# Altium project HYDRA_V4_NAV.PrjPcb (part 1 of 2)
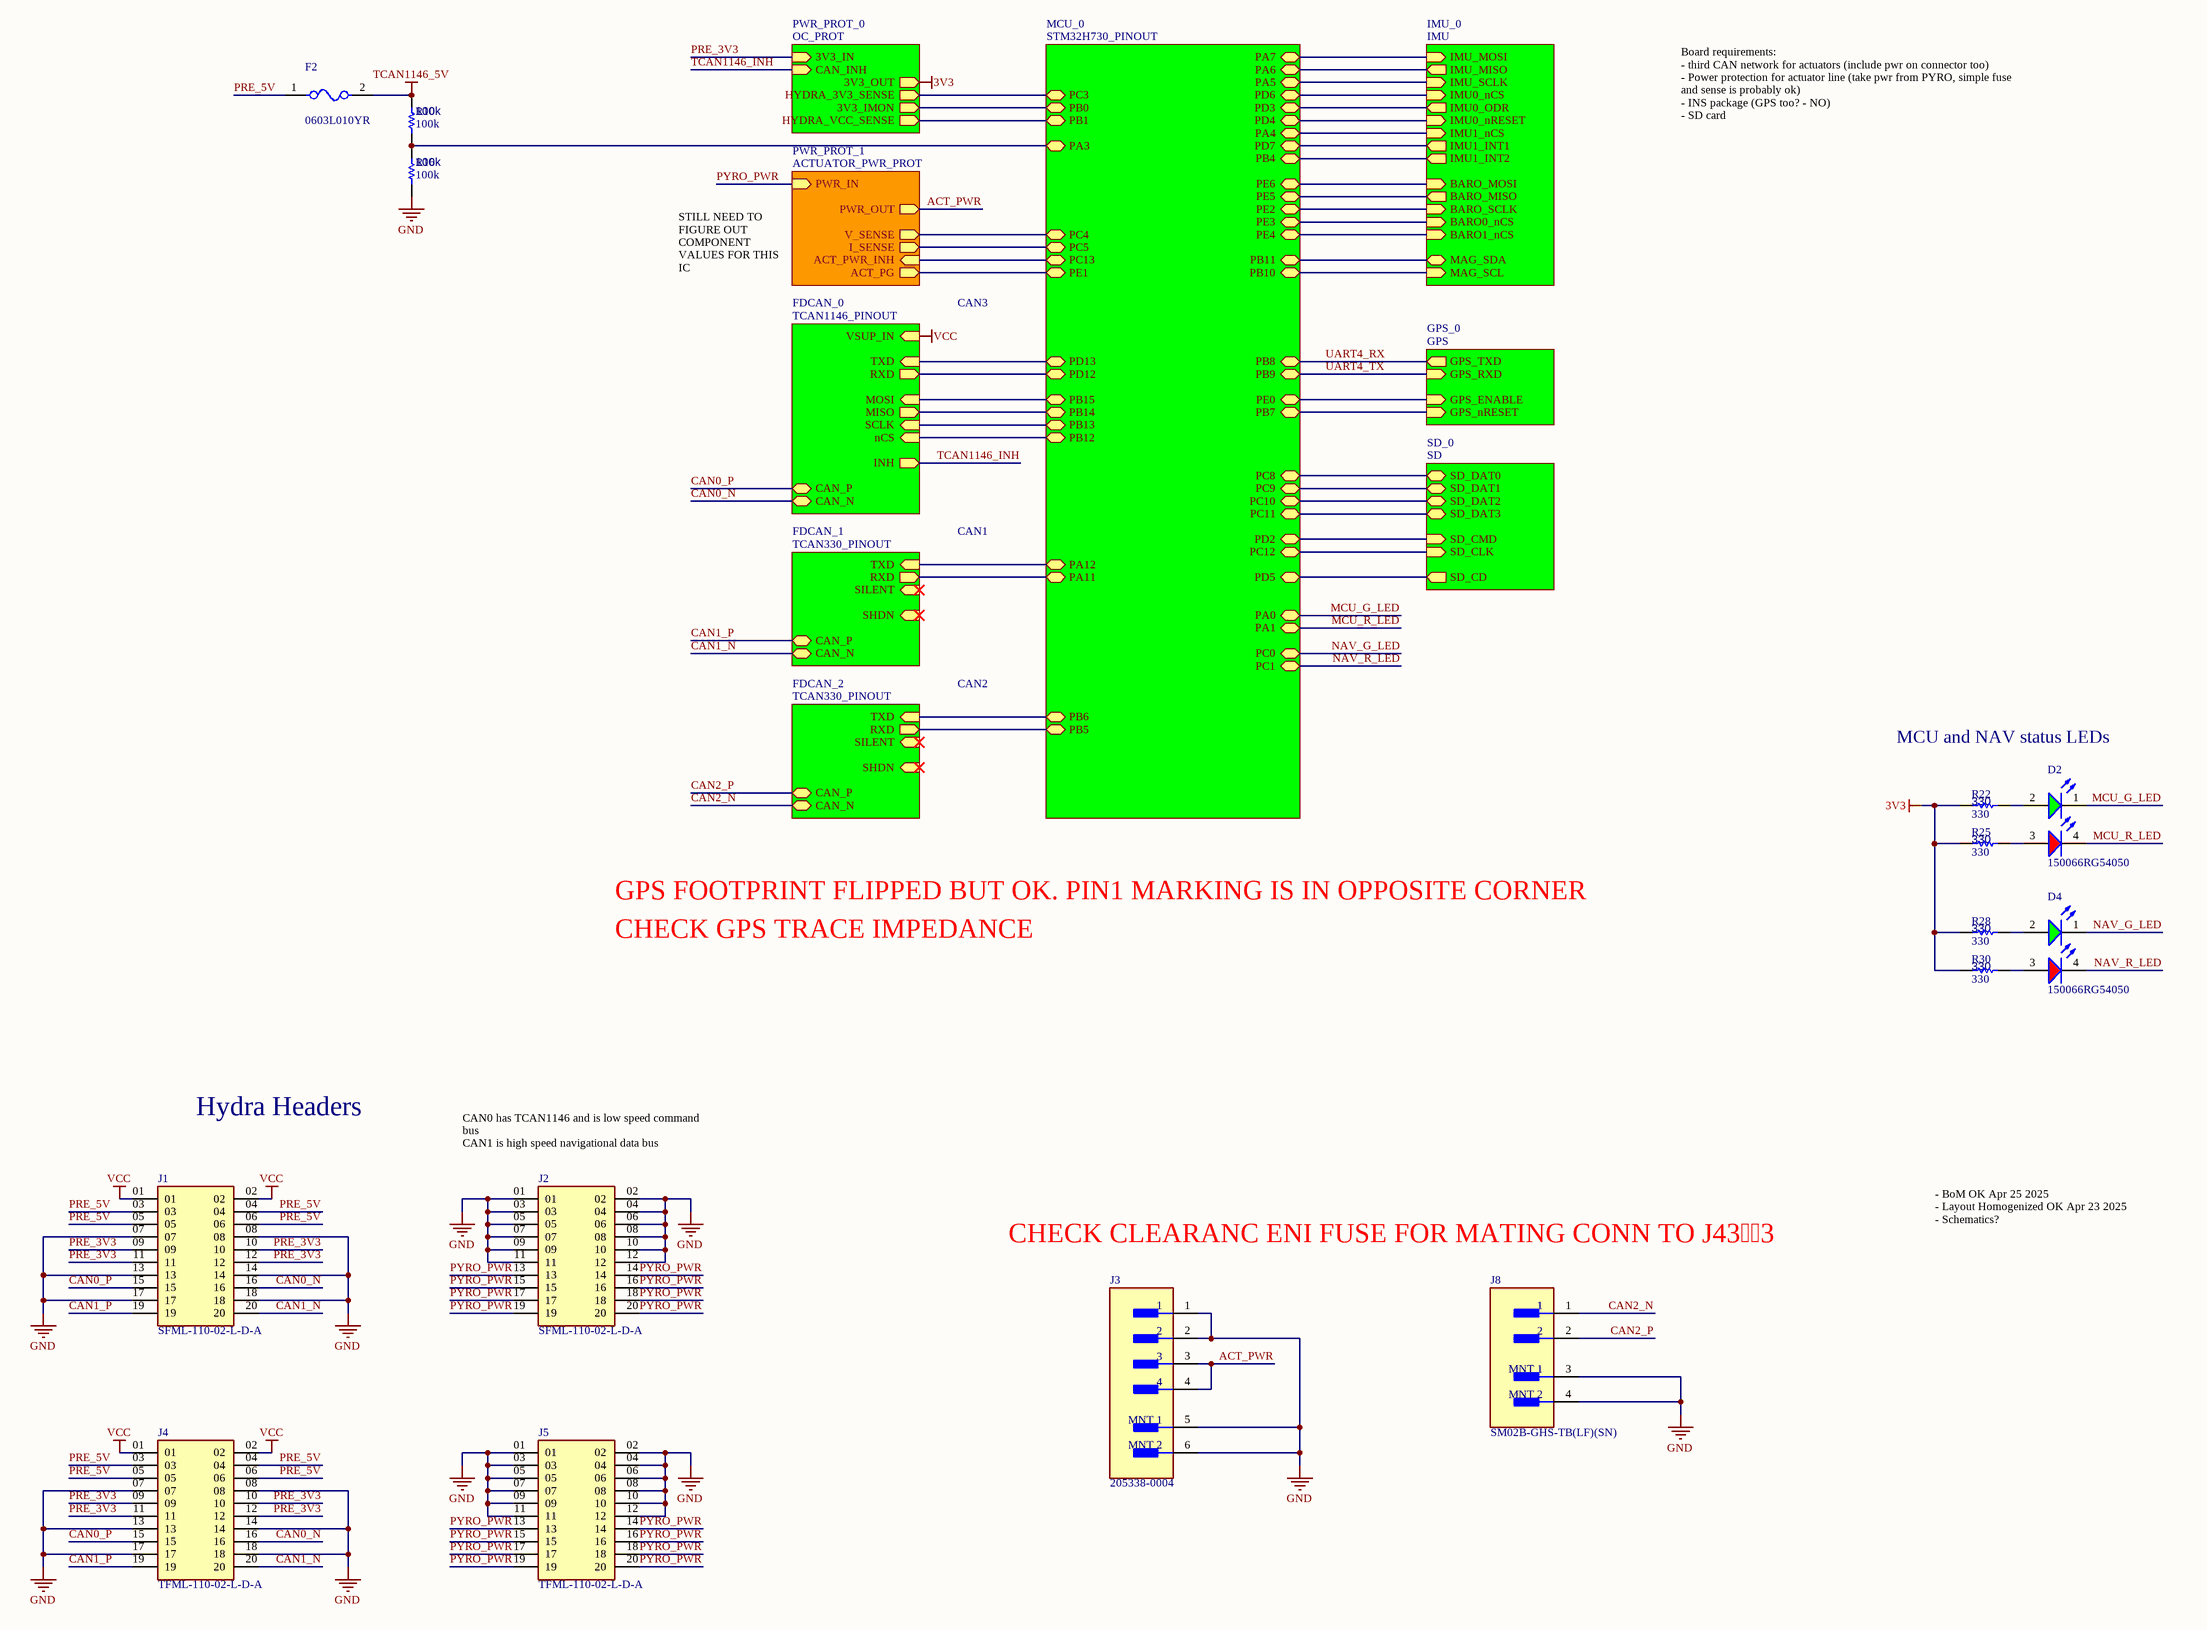
[diagram p0: HYDRA_V4_NAV.SchDoc]
9 sheets, 165 parts. Net scope: hierarchical (ports join the sheet entries above them; power ports are global).
Board file: HYDRA_V4_NAV.PcbDoc
Sheets:
  HYDRA_V4_NAV.SchDoc
    MCU_0 = STM32H730_PINOUT.SchDoc
    IMU_0 = IMU.SchDoc
    GPS_0 = GPS.SchDoc
    SD_0 = SD.SchDoc
    PWR_PROT_0 = OC_PROT.SchDoc
    PWR_PROT_1 = ACTUATOR_PWR_PROT.SchDoc
    FDCAN_1 = TCAN330_PINOUT.SchDoc
    FDCAN_0 = TCAN1146_PINOUT.SchDoc
    FDCAN_2 = TCAN330_PINOUT.SchDoc

## Sheet HYDRA_V4_NAV.SchDoc
size C; SheetNumber: 1; SheetTotal: 9

### Parts
D2  150066RG54050  [WL-SBCD_0606]
D4  150066RG54050  [WL-SBCD_0606]
F2  0603L010YR  [FP-0603L-MFG]
J1  SFML-110-02-L-D-A  [SFML-110-02-L-D-A-Footprint-1]
J2  SFML-110-02-L-D-A  [SFML-110-02-L-D-A-Footprint-1]
J3  205338-0004  [FP-205338-0004-MFG]
J4  TFML-110-02-L-D-A  [TFML-110-02-L-D-A-Footprint-1]
J5  TFML-110-02-L-D-A  [TFML-110-02-L-D-A-Footprint-1]
J8  SM02B-GHS-TB(LF)(SN)  [FP-SM02B-GHS-TB_LF_SN-MFG]
R10  100k  [R0603B]
R16  100k  [R0603B]
R22  330  [R0603B]
R25  330  [R0603B]
R28  330  [R0603B]
R30  330  [R0603B]

### Sub-sheets
FDCAN_0 = TCAN1146_PINOUT: TXD (in), RXD (out), MOSI (in), MISO (out), SCLK (in), nCS (in), INH (out), CAN_P (bidir), CAN_N (bidir), VSUP_IN (in)
FDCAN_1 = TCAN330_PINOUT: TXD (in), RXD (out), SHDN (in), SILENT (in), CAN_P (bidir), CAN_N (bidir)
FDCAN_2 = TCAN330_PINOUT: TXD (in), RXD (out), SHDN (in), SILENT (in), CAN_P (bidir), CAN_N (bidir)
GPS_0 = GPS: GPS_TXD (out), GPS_RXD (in), GPS_ENABLE (in), GPS_nRESET (in)
IMU_0 = IMU: IMU0_nCS (in), IMU0_ODR (out), IMU0_nRESET (in), IMU1_nCS (in), IMU1_INT1 (out), IMU1_INT2 (out), BARO_MOSI (in), BARO_MISO (out), BARO_SCLK (in), BARO0_nCS (in), BARO1_nCS (in), IMU_MOSI (in), IMU_MISO (out), IMU_SCLK (in), MAG_SDA (bidir), MAG_SCL (in)
MCU_0 = STM32H730_PINOUT: PA5 (bidir), PA6 (bidir), PA7 (bidir), PA0 (bidir), PA1 (bidir), PA4 (bidir), PA12 (bidir), PA11 (bidir), PB4 (bidir), PB6 (bidir), PB5 (bidir), PB7 (bidir), PB9 (bidir), PB8 (bidir), PE0 (bidir), PE2 (bidir), PE3 (bidir), PE4 (bidir), PE5 (bidir), PE6 (bidir), PD7 (bidir), PD2 (bidir), PD3 (bidir), PD4 (bidir), PD5 (bidir), PD6 (bidir), PD12 (bidir), PD13 (bidir), PB12 (bidir), PB13 (bidir), PB14 (bidir), PB15 (bidir), PC0 (bidir), PC1 (bidir), PC8 (bidir), PC9 (bidir), PC10 (bidir), PC11 (bidir), PC12 (bidir), PC13 (bidir), PC4 (bidir), PC5 (bidir), PB0 (bidir), PB1 (bidir), PC3 (bidir), PB11 (bidir), PB10 (bidir), PA3 (bidir), PE1 (bidir)
PWR_PROT_0 = OC_PROT: 3V3_IN (in), 3V3_OUT (out), CAN_INH (in), 3V3_IMON (out), HYDRA_3V3_SENSE (out), HYDRA_VCC_SENSE (out)
PWR_PROT_1 = ACTUATOR_PWR_PROT: PWR_IN (in), PWR_OUT (out), V_SENSE (out), I_SENSE (out), ACT_PWR_INH (in), ACT_PG (out)
SD_0 = SD: SD_CD (out), SD_DAT0 (bidir), SD_DAT1 (bidir), SD_DAT2 (bidir), SD_DAT3 (bidir), SD_CMD (in), SD_CLK (in)

### Nets
3V3: R22.1 R25.1 R28.1 R30.1 ; sheet PWR_PROT_0/3V3_OUT
GND: J1.07 J1.08 J1.13 J1.14 J1.17 J1.18 J2.01 J2.02 J2.03 J2.04 J2.05 J2.06 J2.07 J2.08 J2.09 J2.10 J2.11 J2.12 J3.1 J3.2 J3.5(MNT_1) J3.6(MNT_2) J4.07 J4.08 J4.13 J4.14 J4.17 J4.18 J5.01 J5.02 J5.03 J5.04 J5.05 J5.06 J5.07 J5.08 J5.09 J5.10 J5.11 J5.12 J8.3(MNT_1) J8.4(MNT_2) R16.2
TCAN1146_5V: F2.2 R10.1
VCC: J1.01 J1.02 J4.01 J4.02 ; sheet FDCAN_0/VSUP_IN  [project net TCAN1146_VSUP]
ACT_PWR: J3.3 J3.4 ; sheet PWR_PROT_1/PWR_OUT
BARO0_nCS: sheet MCU_0/PE3, sheet IMU_0/BARO0_nCS
BARO1_nCS: sheet MCU_0/PE4, sheet IMU_0/BARO1_nCS
BARO_MISO: sheet MCU_0/PE5, sheet IMU_0/BARO_MISO
BARO_MOSI: sheet MCU_0/PE6, sheet IMU_0/BARO_MOSI
BARO_SCLK: sheet MCU_0/PE2, sheet IMU_0/BARO_SCLK
CAN0_N: J1.16 J4.16 ; sheet FDCAN_0/CAN_N
CAN0_P: J1.15 J4.15 ; sheet FDCAN_0/CAN_P
CAN1_N: J1.20 J4.20 ; sheet FDCAN_1/CAN_N
CAN1_P: J1.19 J4.19 ; sheet FDCAN_1/CAN_P
CAN2_N: J8.1 ; sheet FDCAN_2/CAN_N
CAN2_P: J8.2 ; sheet FDCAN_2/CAN_P
GPS_ENABLE: sheet MCU_0/PE0, sheet GPS_0/GPS_ENABLE
GPS_nRESET: sheet MCU_0/PB7, sheet GPS_0/GPS_nRESET
IMU0_nCS: sheet MCU_0/PD6, sheet IMU_0/IMU0_nCS
IMU0_nRESET: sheet MCU_0/PD4, sheet IMU_0/IMU0_nRESET
IMU0_ODR: sheet MCU_0/PD3, sheet IMU_0/IMU0_ODR
IMU1_INT1: sheet MCU_0/PD7, sheet IMU_0/IMU1_INT1
IMU1_INT2: sheet MCU_0/PB4, sheet IMU_0/IMU1_INT2
IMU1_nCS: sheet MCU_0/PA4, sheet IMU_0/IMU1_nCS
IMU_MISO: sheet MCU_0/PA6, sheet IMU_0/IMU_MISO
IMU_MOSI: sheet MCU_0/PA7, sheet IMU_0/IMU_MOSI
IMU_SCLK: sheet MCU_0/PA5, sheet IMU_0/IMU_SCLK
MAG_SCL: sheet MCU_0/PB10, sheet IMU_0/MAG_SCL
MAG_SDA: sheet MCU_0/PB11, sheet IMU_0/MAG_SDA
MCU_G_LED: D2.1(K) ; sheet MCU_0/PA0
MCU_R_LED: D2.4(K) ; sheet MCU_0/PA1
NAV_G_LED: D4.1(K) ; sheet MCU_0/PC0
NAV_R_LED: D4.4(K) ; sheet MCU_0/PC1
PG: sheet MCU_0/PE1, sheet PWR_PROT_1/ACT_PG
PRE_3V3: J1.09 J1.10 J1.11 J1.12 J4.09 J4.10 J4.11 J4.12 ; sheet PWR_PROT_0/3V3_IN
PRE_5V: F2.1 J1.03 J1.04 J1.05 J1.06 J4.03 J4.04 J4.05 J4.06
PYRO_PWR: J2.13 J2.14 J2.15 J2.16 J2.17 J2.18 J2.19 J2.20 J5.13 J5.14 J5.15 J5.16 J5.17 J5.18 J5.19 J5.20 ; sheet PWR_PROT_1/PWR_IN
SD_CD: sheet MCU_0/PD5, sheet SD_0/SD_CD
SD_CLK: sheet MCU_0/PC12, sheet SD_0/SD_CLK
SD_CMD: sheet MCU_0/PD2, sheet SD_0/SD_CMD
SD_DAT0: sheet MCU_0/PC8, sheet SD_0/SD_DAT0
SD_DAT1: sheet MCU_0/PC9, sheet SD_0/SD_DAT1
SD_DAT2: sheet MCU_0/PC10, sheet SD_0/SD_DAT2
SD_DAT3: sheet MCU_0/PC11, sheet SD_0/SD_DAT3
TCAN1146_INH: sheet PWR_PROT_0/CAN_INH, sheet FDCAN_0/INH  [project net PRE_ZENER_CAN_INH]
UART4_RX: sheet MCU_0/PB8, sheet GPS_0/GPS_TXD  [project net TXD]
UART4_TX: sheet MCU_0/PB9, sheet GPS_0/GPS_RXD  [project net RXD]
NetC1_1: sheet MCU_0/PC5, sheet PWR_PROT_1/I_SENSE
NetD2_2: D2.2(A) R22.2
NetD2_3: D2.3(A) R25.2
NetD4_2: D4.2(A) R28.2
NetD4_3: D4.3(A) R30.2
NetR10_2: R10.2 R16.1 ; sheet MCU_0/PA3
NetR14_1: sheet MCU_0/PB0, sheet PWR_PROT_0/3V3_IMON
NetR21_2: sheet MCU_0/PC3, sheet PWR_PROT_0/HYDRA_3V3_SENSE
NetR51_2: sheet MCU_0/PC4, sheet PWR_PROT_1/V_SENSE
NetR61_1: sheet MCU_0/PC13, sheet PWR_PROT_1/ACT_PWR_INH
NetR67_2: sheet MCU_0/PB1, sheet PWR_PROT_0/HYDRA_VCC_SENSE
NetU1_51: sheet MCU_0/PB12, sheet FDCAN_0/nCS
NetU1_52: sheet MCU_0/PB13, sheet FDCAN_0/SCLK
NetU1_53: sheet MCU_0/PB14, sheet FDCAN_0/MISO
NetU1_54: sheet MCU_0/PB15, sheet FDCAN_0/MOSI
NetU1_59: sheet MCU_0/PD12, sheet FDCAN_0/RXD
NetU1_60: sheet MCU_0/PD13, sheet FDCAN_0/TXD
NetU1_70: sheet MCU_0/PA11, sheet FDCAN_1/RXD
NetU1_71: sheet MCU_0/PA12, sheet FDCAN_1/TXD
NetU1_91: sheet MCU_0/PB5, sheet FDCAN_2/RXD
NetU1_92: sheet MCU_0/PB6, sheet FDCAN_2/TXD

### Notes on the sheet
- STILL NEED TO FIGURE OUT COMPONENT VALUES FOR THIS IC
- CAN3
- Board requirements:
  - third CAN network for actuators (include pwr on connector too)
  - Power protection for actuator line (take pwr from PYRO, simple fuse and sense is probably ok)
  - INS package (GPS too? - NO)
  - SD card
- CAN1
- CAN2
- MCU and NAV status LEDs
- GPS FOOTPRINT FLIPPED BUT OK. PIN1 MARKING IS IN OPPOSITE CORNER
- CHECK GPS TRACE IMPEDANCE
- Hydra Headers
- CAN0 has TCAN1146 and is low speed command bus
  CAN1 is high speed navigational data bus
  CAN2 is high speed actuator data bus
- CHECK CLEARANC ENI FUSE FOR MATING CONN TO J433
- - BoM OK Apr 25 2025
  - Layout Homogenized OK Apr 23 2025
  - Schematics?

### Library data of the parts
D2 D4 = CMP-004-00040-2: Led, Red/Grn, 180Mcd/230Mcd, 624Nm/525Nm Rohs Compliant: Yes; Source: rgled.SchLib; Component Type: Standard; Design Item ID: CMP-004-00034-2; Pins: 4
F2 = CMP-08606-000025-1: PTC RESET FUSE 15V 100MA 0603; Manufacturer: Littelfuse Inc; Value: 0.9-6Ω; Trip Time: 1s; Current Rating: 40A; Trip Current: 0.3A; Hold Current: 0.1A; Octopart: https://octopart.com/0603l010yr-littelfuse-8316166; ComponentLink2URL: https://www.littelfuse.com/~/media/electronics/datasheets/resettable_ptcs/littelfuse_ptc_0603l_datasheet.pdf.pdf; Package: 0603L; Category: Fuse; Mouser Description: Resettable Fuses - PPTC PTC 15V 0603 .100A POLY SURF MOUNT; Automotive: No; Resistance: 0.9-6Ω; Device Class L3: unset; Digikey Description: PTC RESET FUSE 15V 100MA 0603; Lead Free: Yes; Temperature: -40°C to +85°C; Ambient Temperature Range High: +85°C; ComponentLink2Description: Datasheet; RoHS: TRUE; Height: 0.75mm; Temperature Range Low: -40°C; Manufacturer Part Number: 0603L010YR; Device Class L2: PTC Resettable Fuses; Device Class L1: Circuit Protection; Temperature Range High: +85°C; Ambient Temperature Range Low: -40°C; Voltage Rating: 15V
J1 J2 = CMP-002-00043-1: Board Connector, 20 Contact(s), 2 Row(s), Female, Straight, 0.05 inch Pitch, Surface Mount Terminal, Locking, Black Insulator, Socket; RoHS Compliant: Yes; Connector Type: BOARD CONNECTOR; Mounting Technology: Board
J3 = CMP-04776-000717-1: PICO-LOCK 2.0 W/B HEADER ASSY ET
J4 J5 = CMP-002-00042-3: Board Connector, 20 Contact(s), 2 Row(s), Male, Straight, Surface Mount Terminal; Connector Type: BOARD CONNECTOR; Mounting Technology: Board; RoHS Compliant: Yes
J8 = CMP-002-00083-1: MCU 32-bit LPC1800 ARM Cortex M3 RISC 768KB Flash 3.3V 100-Pin TFBGA Tray
R10 R16 R22 R25 R28 R30 = CMP-009-00002-14: Resistor
  R10 R16: Value: 100k
  R22 R25 R28 R30: Value: 330

## Sheet STM32H730_PINOUT.SchDoc
size C; SheetNumber: 3; SheetTotal: 9
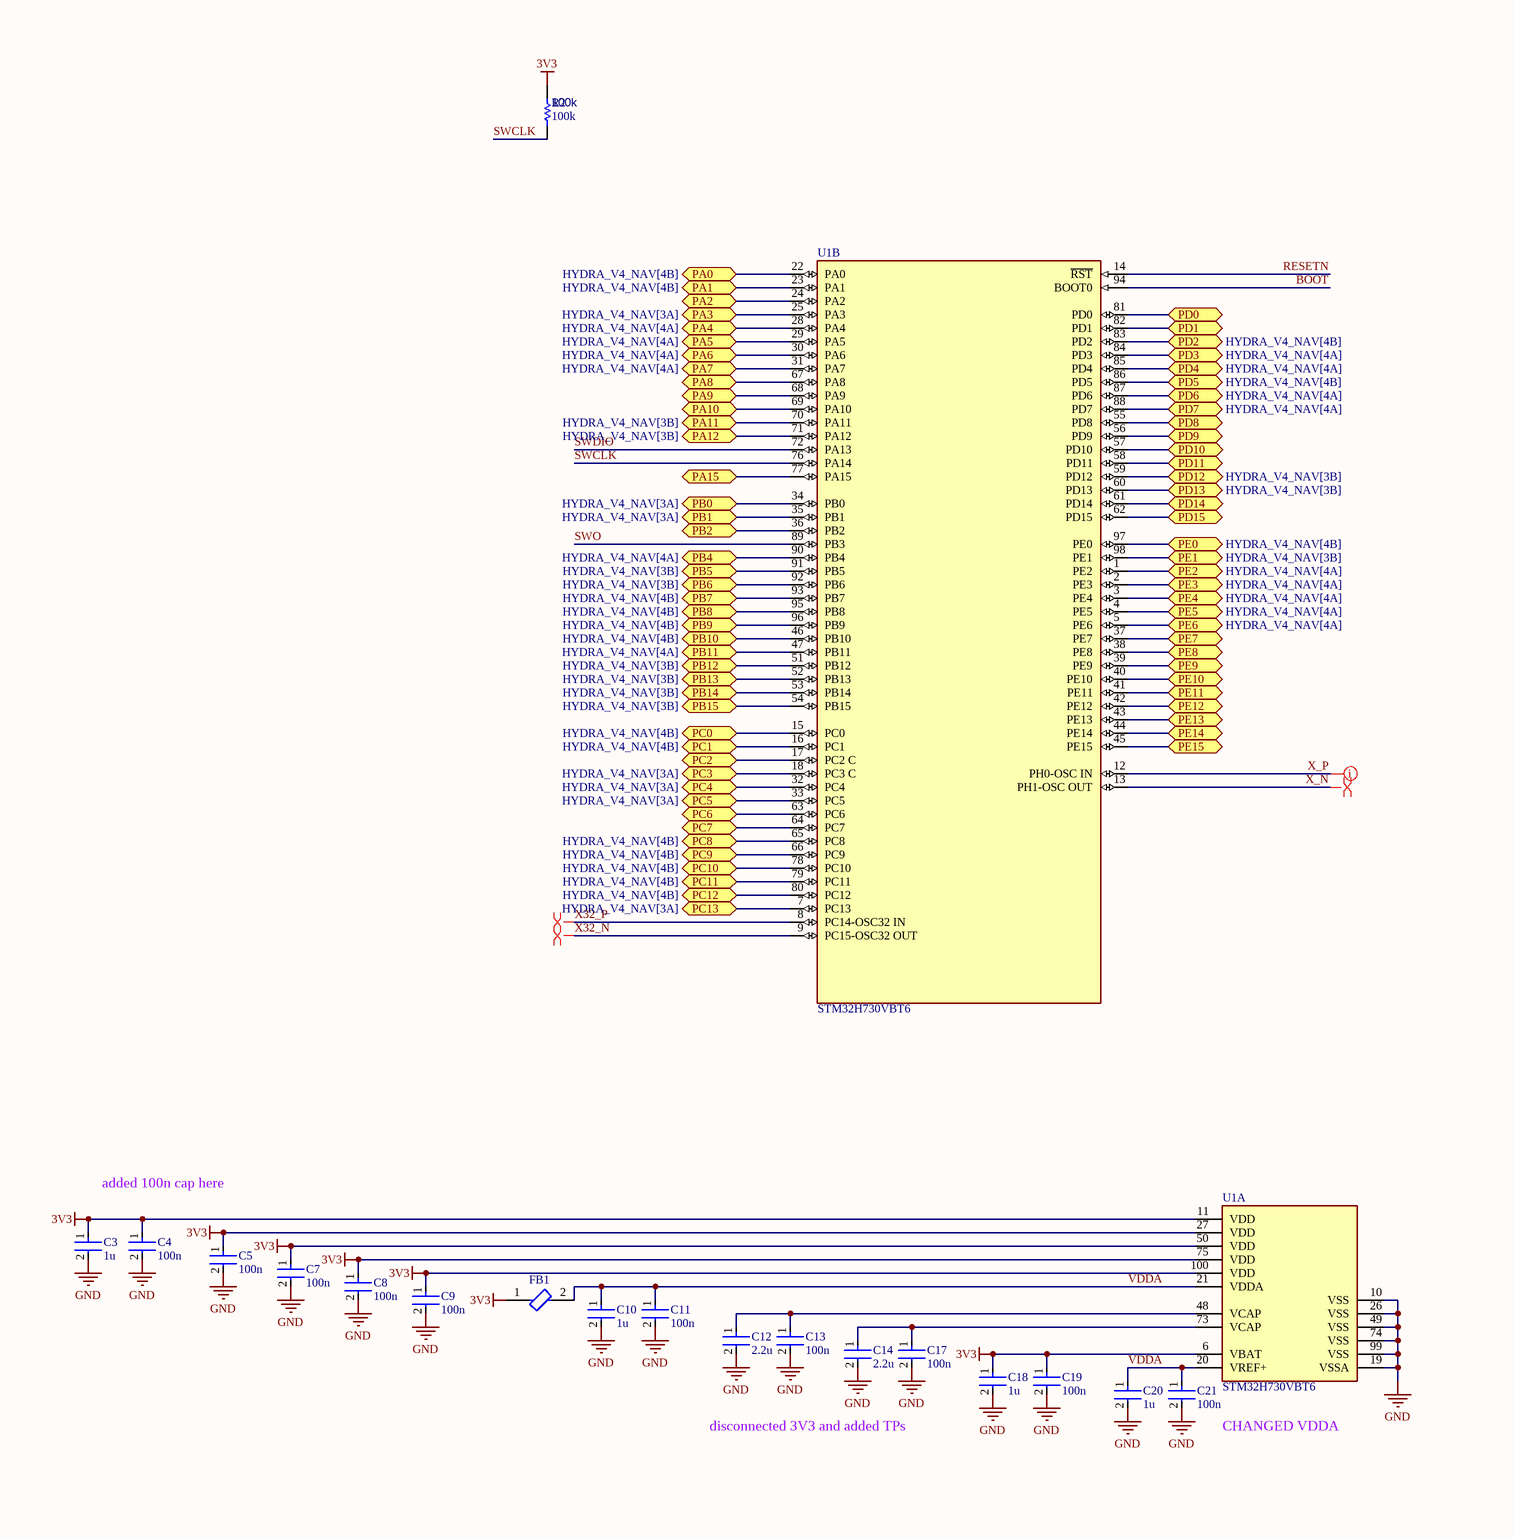
[diagram p1: STM32H730_PINOUT.SchDoc, left]
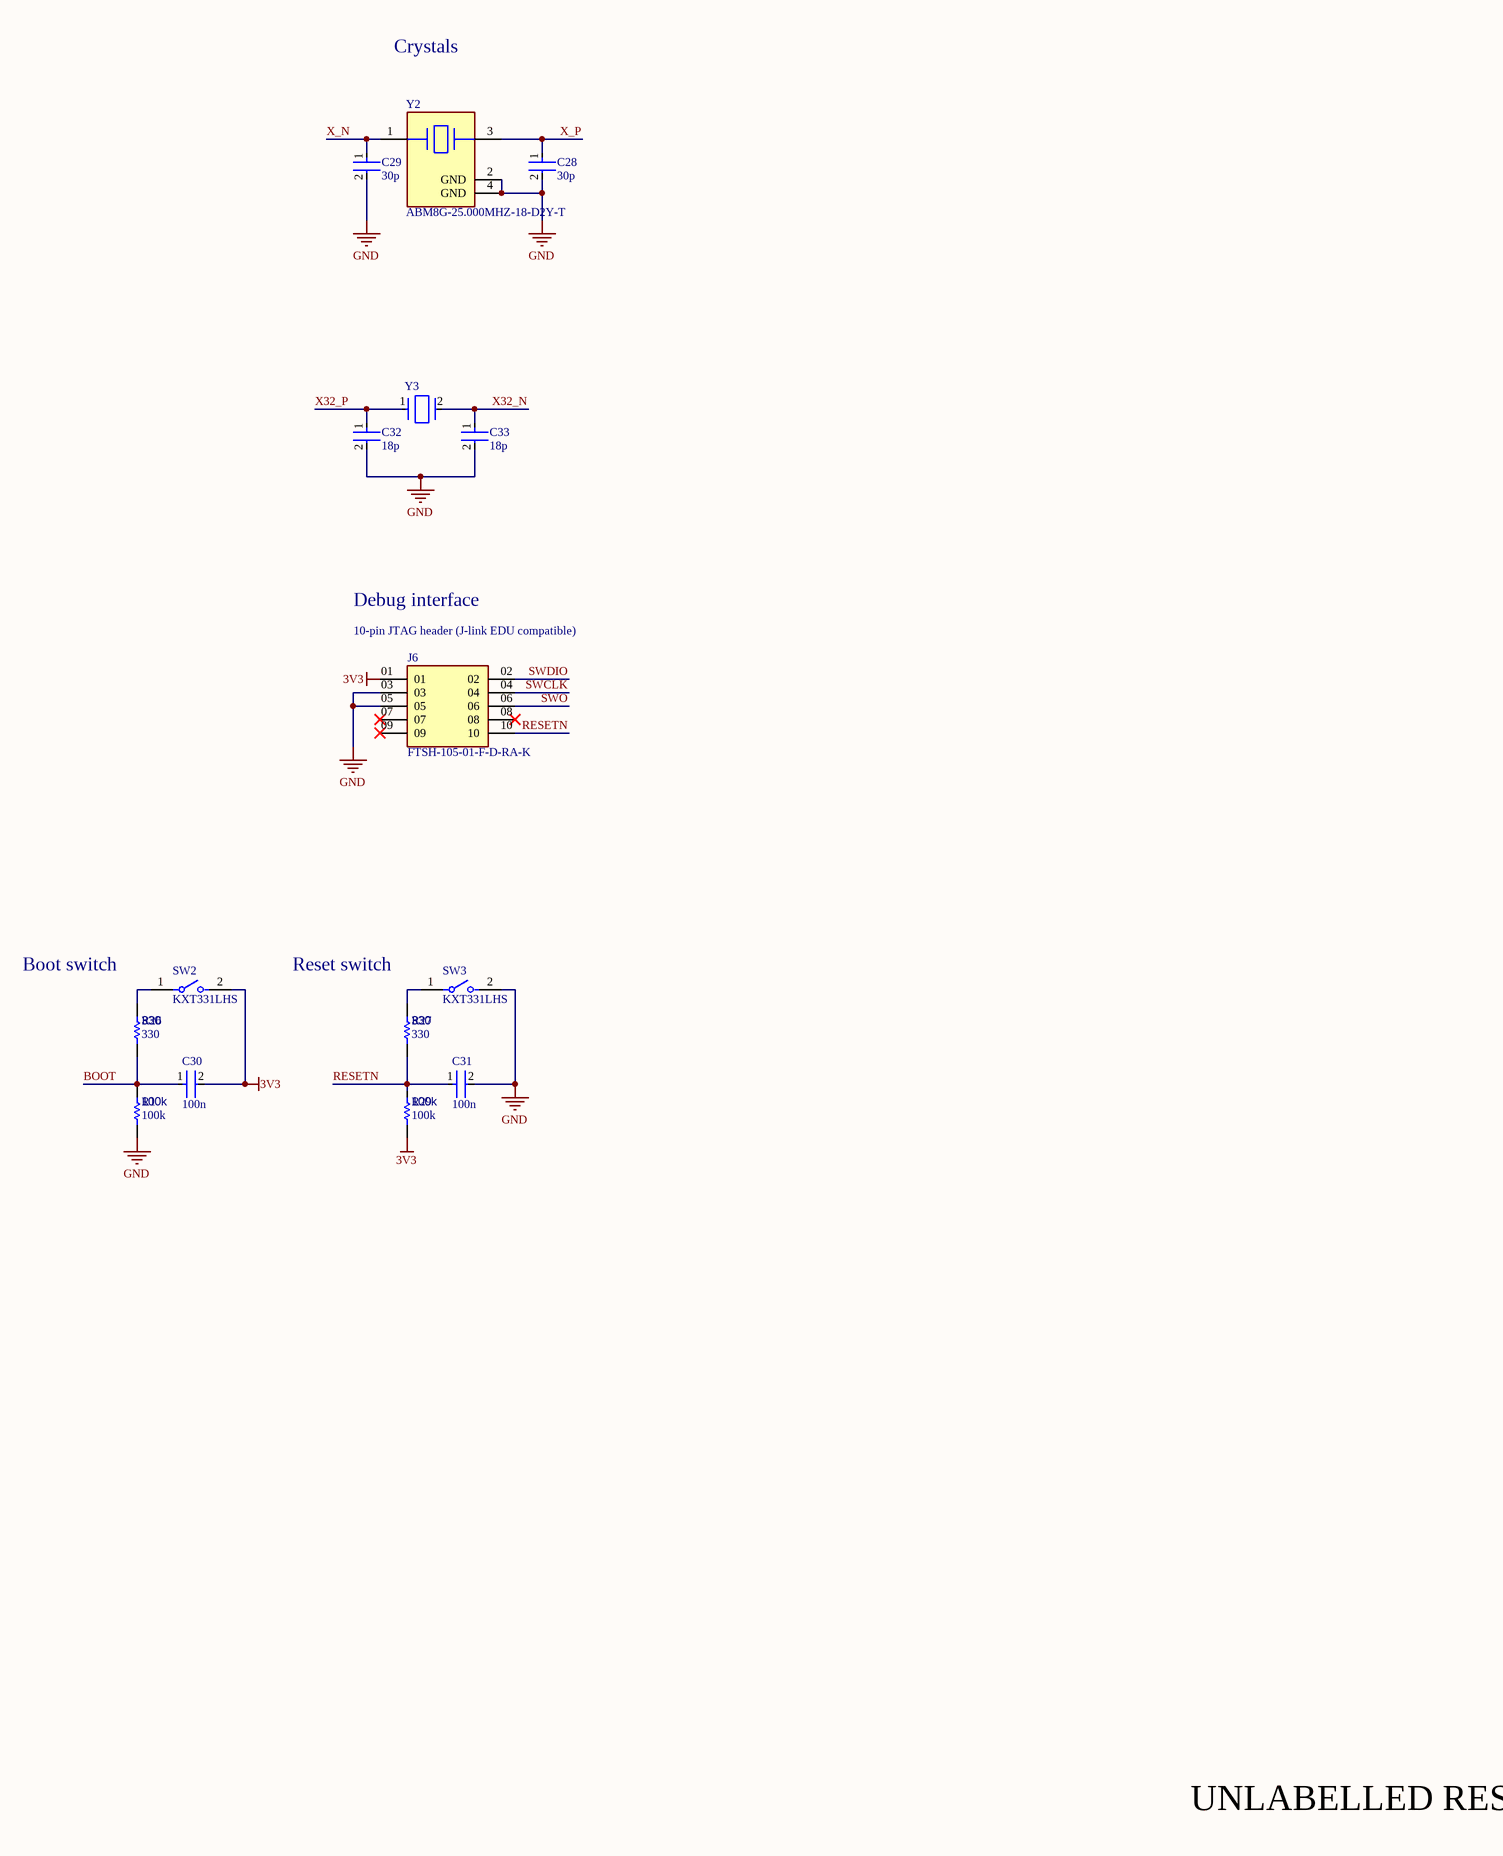
[diagram p2: STM32H730_PINOUT.SchDoc, right]

### Parts
C3  1u  [FP-0402-L_1_0_0_05-W_0_5-IPC_A]
C4  100n  [FP-0402-L_1_0_0_05-W_0_5-IPC_A]
C5  100n  [FP-0402-L_1_0_0_05-W_0_5-IPC_A]
C7  100n  [FP-0402-L_1_0_0_05-W_0_5-IPC_A]
C8  100n  [FP-0402-L_1_0_0_05-W_0_5-IPC_A]
C9  100n  [FP-0402-L_1_0_0_05-W_0_5-IPC_A]
C10  1u  [FP-0402-L_1_0_0_05-W_0_5-IPC_A]
C11  100n  [FP-0402-L_1_0_0_05-W_0_5-IPC_A]
C12  2.2u  [FP-0402-L_1_0_0_05-W_0_5-IPC_A]
C13  100n  [FP-0402-L_1_0_0_05-W_0_5-IPC_A]
C14  2.2u  [FP-0402-L_1_0_0_05-W_0_5-IPC_A]
C17  100n  [FP-0402-L_1_0_0_05-W_0_5-IPC_A]
C18  1u  [FP-0402-L_1_0_0_05-W_0_5-IPC_A]
C19  100n  [FP-0402-L_1_0_0_05-W_0_5-IPC_A]
C20  1u  [FP-0402-L_1_0_0_05-W_0_5-IPC_A]
C21  100n  [FP-0402-L_1_0_0_05-W_0_5-IPC_A]
C28  30p  [FP-0402-L_1_0_0_05-W_0_5-IPC_A]
C29  30p  [FP-0402-L_1_0_0_05-W_0_5-IPC_A]
C30  100n  [FP-0402-L_1_0_0_05-W_0_5-IPC_A]
C31  100n  [FP-0402-L_1_0_0_05-W_0_5-IPC_A]
C32  18p  [FP-0402-L_1_0_0_05-W_0_5-IPC_A]
C33  18p  [FP-0402-L_1_0_0_05-W_0_5-IPC_A]
FB1  BLM15PX601SN1D  [FP-BLM15-0_05-MFG]  (value not drawn)
J6  FTSH-105-01-F-D-RA-K  [FTSH-105-01-F-D-RA-K-Footprint-1]
R1  100k  [R0603B]
R2  100k  [R0603B]
R26  330  [R0603B]
R27  330  [R0603B]
R29  100k  [R0603B]
SW2  KXT331LHS  [FP-KXT331LHS-MFG]
SW3  KXT331LHS  [FP-KXT331LHS-MFG]
U1  STM32H730VBT6  [FP-LQFP100-1L-IPC_C]  (parts A,B of 2)
Y2  ABM8G-25.000MHZ-18-D2Y-T  [FP-ABM8G-MFG]
Y3  ECS-.327-12.5-1210-TR  [FP-ECX-1210-MFG]  (value not drawn)

### Ports
PA0 (bidir, see HYDRA_V4_NAV[4B]), PA1 (bidir, see HYDRA_V4_NAV[4B]), PA2 (bidir), PA3 (bidir, see HYDRA_V4_NAV[3A]), PA4 (bidir, see HYDRA_V4_NAV[4A]), PA5 (bidir, see HYDRA_V4_NAV[4A]), PA6 (bidir, see HYDRA_V4_NAV[4A]), PA7 (bidir, see HYDRA_V4_NAV[4A]), PA8 (bidir), PA9 (bidir), PA10 (bidir), PA11 (bidir, see HYDRA_V4_NAV[3B]), PA12 (bidir, see HYDRA_V4_NAV[3B]), PA15 (bidir), PB0 (bidir, see HYDRA_V4_NAV[3A]), PB1 (bidir, see HYDRA_V4_NAV[3A]), PB2 (bidir), PB4 (bidir, see HYDRA_V4_NAV[4A]), PB5 (bidir, see HYDRA_V4_NAV[3B]), PB6 (bidir, see HYDRA_V4_NAV[3B]), PB7 (bidir, see HYDRA_V4_NAV[4B]), PB8 (bidir, see HYDRA_V4_NAV[4B]), PB9 (bidir, see HYDRA_V4_NAV[4B]), PB10 (bidir, see HYDRA_V4_NAV[4B]), PB11 (bidir, see HYDRA_V4_NAV[4A]), PB12 (bidir, see HYDRA_V4_NAV[3B]), PB13 (bidir, see HYDRA_V4_NAV[3B]), PB14 (bidir, see HYDRA_V4_NAV[3B]), PB15 (bidir, see HYDRA_V4_NAV[3B]), PC0 (bidir, see HYDRA_V4_NAV[4B]), PC1 (bidir, see HYDRA_V4_NAV[4B]), PC2 (bidir), PC3 (bidir, see HYDRA_V4_NAV[3A]), PC4 (bidir, see HYDRA_V4_NAV[3A]), PC5 (bidir, see HYDRA_V4_NAV[3A]), PC6 (bidir), PC7 (bidir), PC8 (bidir, see HYDRA_V4_NAV[4B]), PC9 (bidir, see HYDRA_V4_NAV[4B]), PC10 (bidir, see HYDRA_V4_NAV[4B]), PC11 (bidir, see HYDRA_V4_NAV[4B]), PC12 (bidir, see HYDRA_V4_NAV[4B]), PC13 (bidir, see HYDRA_V4_NAV[3A]), PD0 (bidir), PD1 (bidir), PD2 (bidir, see HYDRA_V4_NAV[4B]), PD3 (bidir, see HYDRA_V4_NAV[4A]), PD4 (bidir, see HYDRA_V4_NAV[4A]), PD5 (bidir, see HYDRA_V4_NAV[4B]), PD6 (bidir, see HYDRA_V4_NAV[4A]), PD7 (bidir, see HYDRA_V4_NAV[4A]), PD8 (bidir), PD9 (bidir), PD10 (bidir), PD11 (bidir), PD12 (bidir, see HYDRA_V4_NAV[3B]), PD13 (bidir, see HYDRA_V4_NAV[3B]), PD14 (bidir), PD15 (bidir), PE0 (bidir, see HYDRA_V4_NAV[4B]), PE1 (bidir, see HYDRA_V4_NAV[3B]), PE2 (bidir, see HYDRA_V4_NAV[4A]), PE3 (bidir, see HYDRA_V4_NAV[4A]), PE4 (bidir, see HYDRA_V4_NAV[4A]), PE5 (bidir, see HYDRA_V4_NAV[4A]), PE6 (bidir, see HYDRA_V4_NAV[4A]), PE7 (bidir), PE8 (bidir), PE9 (bidir), PE10 (bidir), PE11 (bidir), PE12 (bidir), PE13 (bidir), PE14 (bidir), PE15 (bidir)

### Nets
3V3: C3.1 C4.1 C5.1 C7.1 C8.1 C9.1 C18.1 C19.1 C30.2 FB1.1 J6.01 R2.1 R29.2 SW2.2 U1.6(VBAT) U1.11(VDD) U1.27(VDD) U1.50(VDD) U1.75(VDD) U1.100(VDD)
GND: C3.2 C4.2 C5.2 C7.2 C8.2 C9.2 C10.2 C11.2 C12.2 C13.2 C14.2 C17.2 C18.2 C19.2 C20.2 C21.2 C28.2 C29.2 C31.2 C32.2 C33.2 J6.03 J6.05 R1.2 SW3.2 U1.10(VSS) U1.19(VSSA) U1.26(VSS) U1.49(VSS) U1.74(VSS) U1.99(VSS) Y2.2(GND) Y2.4(GND)
BARO0_nCS: U1.2(PE3) ; port PE3
BARO1_nCS: U1.3(PE4) ; port PE4
BARO_MISO: U1.4(PE5) ; port PE5
BARO_MOSI: U1.5(PE6) ; port PE6
BARO_SCLK: U1.1(PE2) ; port PE2
BOOT: C30.1 R1.1 R26.2 U1.94(BOOT0)
GPS_ENABLE: U1.97(PE0) ; port PE0
GPS_nRESET: U1.93(PB7) ; port PB7
IMU0_nCS: U1.87(PD6) ; port PD6
IMU0_nRESET: U1.85(PD4) ; port PD4
IMU0_ODR: U1.84(PD3) ; port PD3
IMU1_INT1: U1.88(PD7) ; port PD7
IMU1_INT2: U1.90(PB4) ; port PB4
IMU1_nCS: U1.28(PA4) ; port PA4
IMU_MISO: U1.30(PA6) ; port PA6
IMU_MOSI: U1.31(PA7) ; port PA7
IMU_SCLK: U1.29(PA5) ; port PA5
MAG_SCL: U1.46(PB10) ; port PB10
MAG_SDA: U1.47(PB11) ; port PB11
MCU_G_LED: U1.22(PA0) ; port PA0
MCU_R_LED: U1.23(PA1) ; port PA1
NAV_G_LED: U1.15(PC0) ; port PC0
NAV_R_LED: U1.16(PC1) ; port PC1
PG: U1.98(PE1) ; port PE1
RESETN: C31.1 J6.10 R27.2 R29.1 U1.14(~{RST})
RXD: U1.96(PB9) ; port PB9
SD_CD: U1.86(PD5) ; port PD5
SD_CLK: U1.80(PC12) ; port PC12
SD_CMD: U1.83(PD2) ; port PD2
SD_DAT0: U1.65(PC8) ; port PC8
SD_DAT1: U1.66(PC9) ; port PC9
SD_DAT2: U1.78(PC10) ; port PC10
SD_DAT3: U1.79(PC11) ; port PC11
SWCLK: J6.04 R2.2 U1.76(PA14)
SWDIO: J6.02 U1.72(PA13)
SWO: J6.06 U1.89(PB3)
TXD: U1.95(PB8) ; port PB8
VDDA: C10.1 C11.1 C20.1 C21.1 FB1.2 U1.20(VREF+) U1.21(VDDA)
X32_N: C33.1 U1.9(PC15-OSC32_OUT) Y3.2(Out/In)
X32_P: C32.1 U1.8(PC14-OSC32_IN) Y3.1(In/Out)
X_N: C29.1 U1.13(PH1-OSC_OUT) Y2.1
X_P: C28.1 U1.12(PH0-OSC_IN) Y2.3
NetC1_1: U1.33(PC5) ; port PC5
NetC12_1: C12.1 C13.1 U1.48(VCAP)
NetC14_1: C14.1 C17.1 U1.73(VCAP)
NetR10_2: U1.25(PA3) ; port PA3
NetR14_1: U1.34(PB0) ; port PB0
NetR21_2: U1.18(PC3_C) ; port PC3
NetR26_1: R26.1 SW2.1
NetR27_1: R27.1 SW3.1
NetR51_2: U1.32(PC4) ; port PC4
NetR61_1: U1.7(PC13) ; port PC13
NetR67_2: U1.35(PB1) ; port PB1
NetU1_17: U1.17(PC2_C) ; port PC2
NetU1_24: U1.24(PA2) ; port PA2
NetU1_36: U1.36(PB2) ; port PB2
NetU1_37: U1.37(PE7) ; port PE7
NetU1_38: U1.38(PE8) ; port PE8
NetU1_39: U1.39(PE9) ; port PE9
NetU1_40: U1.40(PE10) ; port PE10
NetU1_41: U1.41(PE11) ; port PE11
NetU1_42: U1.42(PE12) ; port PE12
NetU1_43: U1.43(PE13) ; port PE13
NetU1_44: U1.44(PE14) ; port PE14
NetU1_45: U1.45(PE15) ; port PE15
NetU1_51: U1.51(PB12) ; port PB12
NetU1_52: U1.52(PB13) ; port PB13
NetU1_53: U1.53(PB14) ; port PB14
NetU1_54: U1.54(PB15) ; port PB15
NetU1_55: U1.55(PD8) ; port PD8
NetU1_56: U1.56(PD9) ; port PD9
NetU1_57: U1.57(PD10) ; port PD10
NetU1_58: U1.58(PD11) ; port PD11
NetU1_59: U1.59(PD12) ; port PD12
NetU1_60: U1.60(PD13) ; port PD13
NetU1_61: U1.61(PD14) ; port PD14
NetU1_62: U1.62(PD15) ; port PD15
NetU1_63: U1.63(PC6) ; port PC6
NetU1_64: U1.64(PC7) ; port PC7
NetU1_67: U1.67(PA8) ; port PA8
NetU1_68: U1.68(PA9) ; port PA9
NetU1_69: U1.69(PA10) ; port PA10
NetU1_70: U1.70(PA11) ; port PA11
NetU1_71: U1.71(PA12) ; port PA12
NetU1_77: U1.77(PA15) ; port PA15
NetU1_81: U1.81(PD0) ; port PD0
NetU1_82: U1.82(PD1) ; port PD1
NetU1_91: U1.91(PB5) ; port PB5
NetU1_92: U1.92(PB6) ; port PB6

Not connected (* = marked no-connect by the designer): J6 07* 08* 09*

### Layout directives
differential pair: X32_N, X32_P, X_N, X_P

### Notes on the sheet
- Crystals
- Debug interface
- (near J6) 10-pin JTAG header (J-link EDU compatible)
- Boot switch
- Reset switch
- added 100n cap here
- disconnected 3V3 and added TPs
- CHANGED VDDA
- UNLABELLED RESISTORS ARE JUMPERS

### Library data of the parts
C3-C5 C7-C14 C17-C21 C28-C33 = CMP-001-00058-1: LARGE PADS, 0402 CAP, CHANGE COMMENT TO MATCH REAL P/N; Capacitor Type: Ceramic; Min Operating Temperature: -55°C; Mounting Technology: Surface Mount; Pins: 2; Case/Package: 0402; RoHS Compliant: Yes; Max Operating Temperature: 85°C
  C3 C10 C18 C20: Value: 1u
  C4 C5 C7-C9 C11 C13 C17 C19 C21 C30 C31: Value: 100n
  C12 C14: Value: 2.2u
  C28 C29: Value: 30p
  C32 C33: Value: 18p
FB1 = CMP-0686-00252-4: Chip Ferrite Bead, 0402, 600Ω @ 100MHz, 0.23Ω, 25%, 900mA; Number of Circuits: 1; Impedance: 600R; DC Resistance (DCR): 230mR; Material: Steel; Length: 1mm; Package Quantity: 10000; Height: 0.5mm; Width: 0.5mm; Max DC Current: 900mA; Number of Lines: 1; Termination: SMD/SMT; Packaging: Tape and Reel; Lead Free: Lead Free; Min Operating Temperature: -55°C; Max Operating Temperature: 125°C; Max Current Rating: 900mA; Case Code (Imperial): 0402; Number of Pins: 2; Current Rating: 900mA; Test Frequency: 100MHz; Case/Package: 0402; Tolerance: 25%; Case Code (Metric): 1005
J6 = CMP-002-00041-5: Board Connector, 10 Contact(s), 2 Row(s), Male, Right Angle, 0.05 inch Pitch, Surface Mount Terminal, Locking, Black Insulator; Connector Type: BOARD CONNECTOR; Mounting Technology: Board; RoHS Compliant: Yes
R1 R2 R26 R27 R29 = CMP-009-00002-14: Resistor
  R1 R2 R29: Value: 100k
  R26 R27: Value: 330
SW2 SW3 = CMP-10040-000029-1: SWITCH TACTILE SPST-NO 0.02A 15V; Operating Force: 240gf; Switch Travel: 0.13mm; Illumination Type: Non-Illuminated; Throw Configuration: SPST; Number of Ports: 1; Current Rating: 5A; Mechanical Life: 500000Cycles; Switch Function: Off-Mom; Connector Type: USB; Actuator Type: Standard; Gender: Receptacle; Number of Contacts: 24; Contact Plating: Gold; Insulation Color: Black; Min Operating Temperature: -40°C; Packaging: Tape and Reel; Flammability Rating: UL94 V-0; Max Operating Temperature: 85°C; Termination: Solder; Mount: Surface Mount
U1 = CMP-12105-000107-1: IC MCU 32BIT 128KB FLASH 100LQFP
Y2 = CMP-2000-05733-3: Crystal 25MHz ±20ppm (Tol) ±30ppm (Stability) 18pF FUND 60Ω 4-Pin SMD T/R; Series Resistance: 60R; Length: 3.2mm; Depth: 2.5mm; Packaging: Tape and Reel; Min Operating Temperature: -40°C; Operating Frequency: 25 MHz; Lead Free: Lead Free; Number of Pins: 4; Frequency Tolerance: 20ppm; Radiation Hardening: No; Max Operating Temperature: 85°C; Termination: SMD/SMT; Frequency Stability: 30ppm; Frequency: 25MHz; Series: ABM8G; Mount: Surface Mount; Package Quantity: 1000; Height: 0.039inch; Width: 0.098inch; Case/Package: CSMD; ESR (Equivalent Series Resistance): 60R; Load Capacitance: 18pF; Tolerance: 20ppm
Y3 = CMP-40224-000006-1: CRYSTAL 32.7680KHZ 12.5PF SMD; Manufacturer: ECS International; Frequency: 32.768kHz; Esr: 90kΩ; Tolerance: 20ppm; Device Class L1: Passive Components; Load Capacitance: 12.5pF; Temperature: -40°C to +85°C; ComponentLink2URL: https://ecsxtal.com/store/pdf/ECX-1210.pdf; Series: ECX-1210; Octopart: https://octopart.com/ecs-.327-12.5-1210-tr-ecs+international-81221340; ComponentLink2Description: Datasheet; Temperature Range Low: -40°C; Digikey Description: CRYSTAL 32.7680KHZ 12.5PF SMD; Lead Free: Yes; RoHS: TRUE; Device Class L3: Crystals; Automotive: No; Category: Crys; Height: 0.5mm; Manufacturer Part Number: ECS-.327-12.5-1210-TR; Temperature Range High: +85°C; Device Class L2: Crystals / Oscillators; Package: ECX-1210

## Sheet IMU.SchDoc
size B; SheetNumber: 6; SheetTotal: 9
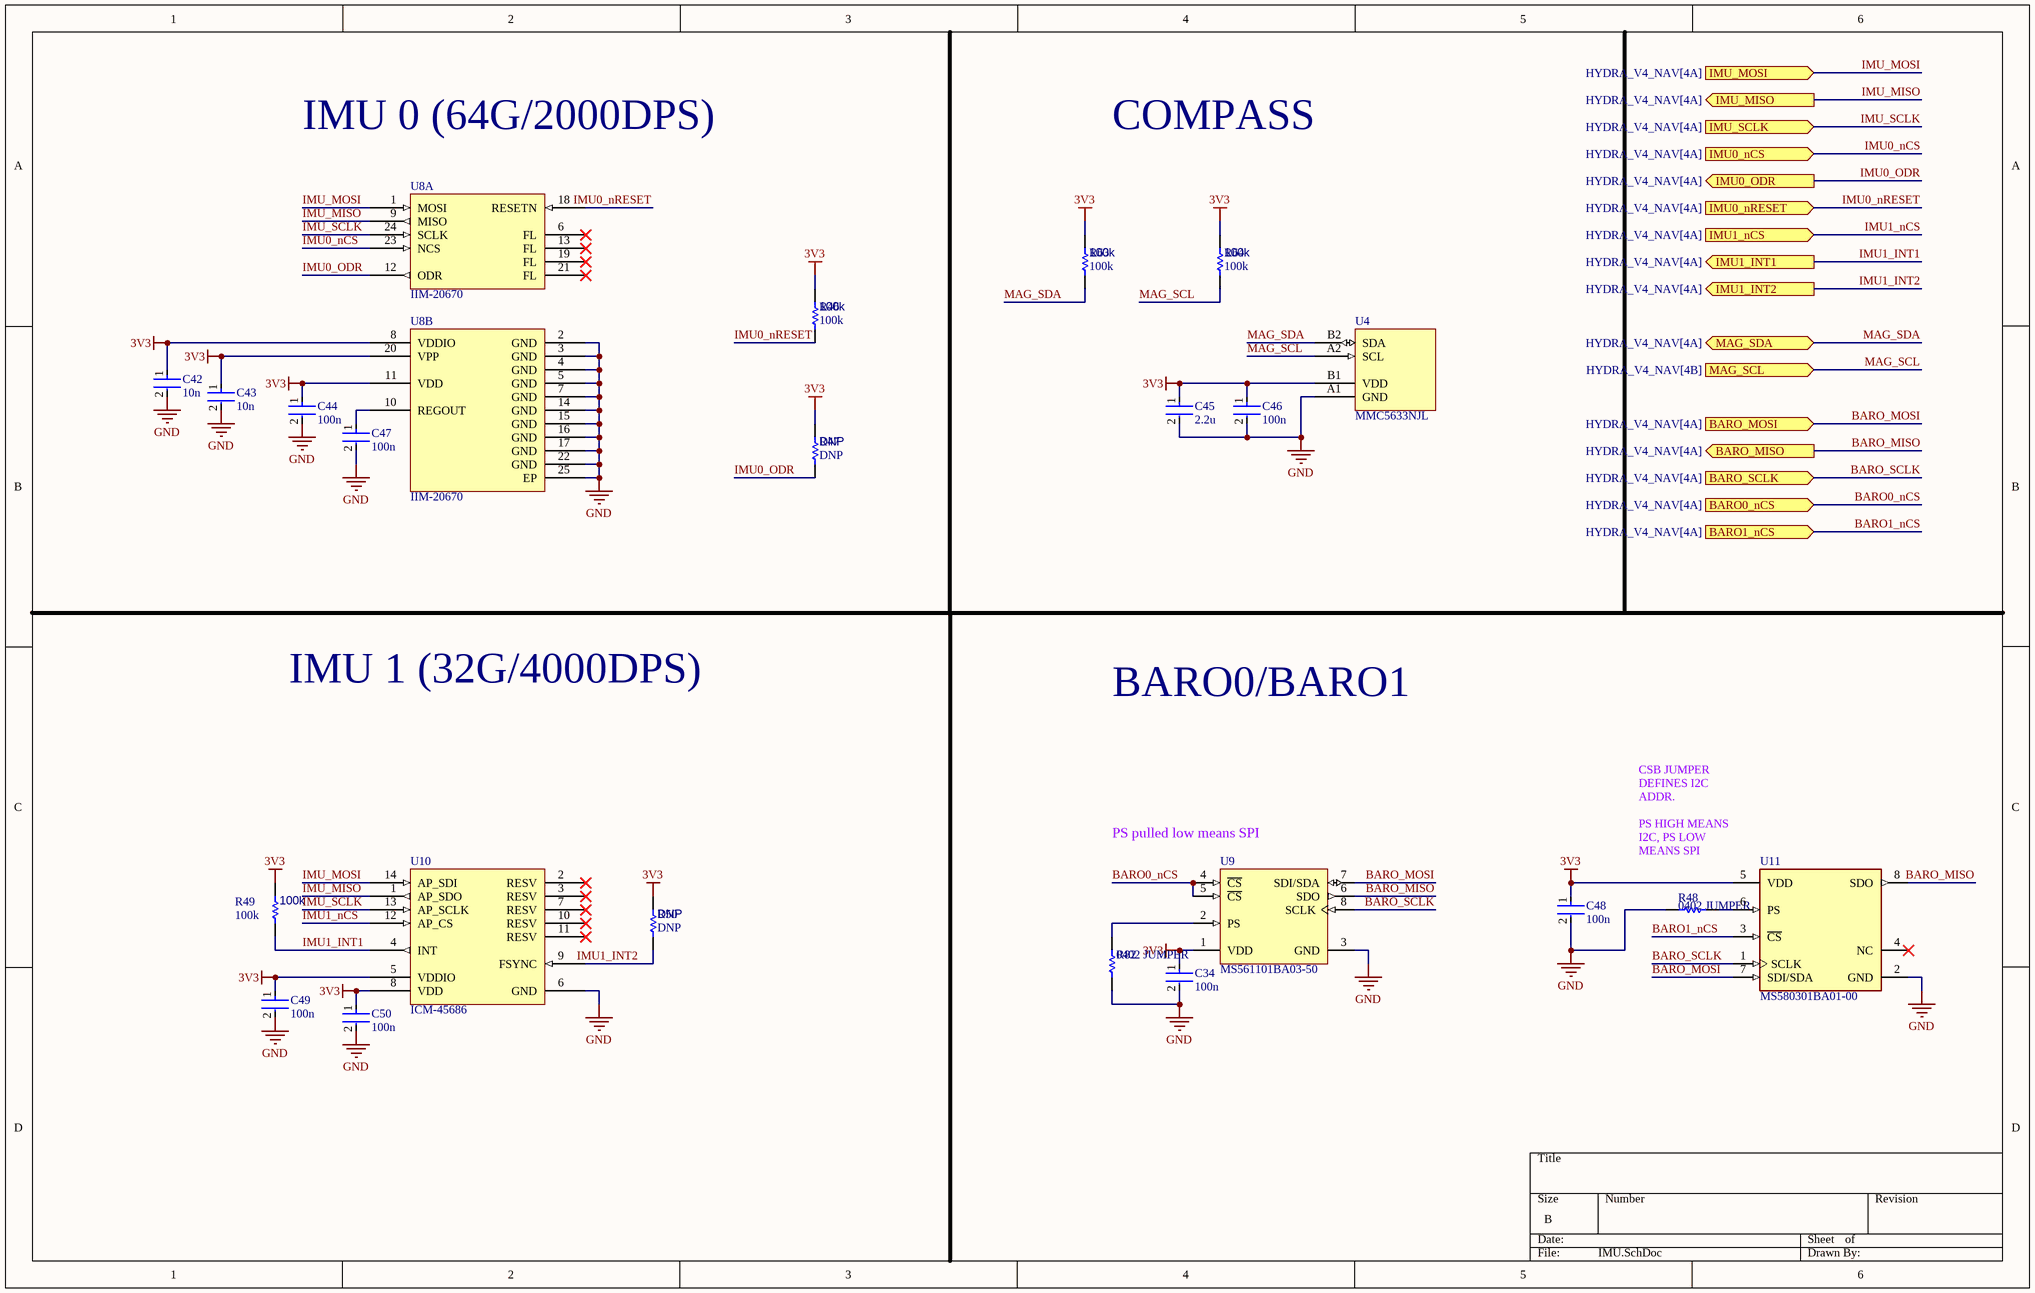
[diagram p3: IMU.SchDoc]

### Parts
C34  100n  [FP-0402-L_1_0_0_05-W_0_5-IPC_A]
C42  10n  [FP-0402-L_1_0_0_05-W_0_5-IPC_A]
C43  10n  [FP-0402-L_1_0_0_05-W_0_5-IPC_A]
C44  100n  [FP-0402-L_1_0_0_05-W_0_5-IPC_A]
C45  2.2u  [FP-0402-L_1_0_0_05-W_0_5-IPC_A]
C46  100n  [FP-0402-L_1_0_0_05-W_0_5-IPC_A]
C47  100n  [FP-0402-L_1_0_0_05-W_0_5-IPC_A]
C48  100n  [FP-0402-L_1_0_0_05-W_0_5-IPC_A]
C49  100n  [FP-0402-L_1_0_0_05-W_0_5-IPC_A]
C50  100n  [FP-0402-L_1_0_0_05-W_0_5-IPC_A]
R46  100k  [R0603B]
R47  DNP  [R0603B]
R48  0402 JUMPER  [RESC1005X40X25ML05T05]
R49  100k  [R0603B]
R50  DNP  [R0603B]
R63  100k  [R0603B]
R64  100k  [R0603B]
R82  0402 JUMPER  [RESC1005X40X25ML05T05]
U4  MMC5633NJL  [BGA4C40P2X2_85X85X60]
U8  IIM-20670  [PQFN50P450X450X115_HS-25N]  (parts A,B of 2)
U9  MS561101BA03-50  [MSI-MS561101BA03-50-8_V]
U10  ICM-45686  [PQFN50P300X250X86-14N]
U11  MS580301BA01-00  [FP-MS580301BA01-00-MFG]

### Ports
BARO0_nCS (in, see HYDRA_V4_NAV[4A]), BARO1_nCS (in, see HYDRA_V4_NAV[4A]), BARO_MISO (out, see HYDRA_V4_NAV[4A]), BARO_MOSI (in, see HYDRA_V4_NAV[4A]), BARO_SCLK (in, see HYDRA_V4_NAV[4A]), IMU0_nCS (in, see HYDRA_V4_NAV[4A]), IMU0_nRESET (in, see HYDRA_V4_NAV[4A]), IMU0_ODR (out, see HYDRA_V4_NAV[4A]), IMU1_INT1 (out, see HYDRA_V4_NAV[4A]), IMU1_INT2 (out, see HYDRA_V4_NAV[4A]), IMU1_nCS (in, see HYDRA_V4_NAV[4A]), IMU_MISO (out, see HYDRA_V4_NAV[4A]), IMU_MOSI (in, see HYDRA_V4_NAV[4A]), IMU_SCLK (in, see HYDRA_V4_NAV[4A]), MAG_SCL (in, see HYDRA_V4_NAV[4B]), MAG_SDA (bidir, see HYDRA_V4_NAV[4A])

### Nets
3V3: C34.1 C42.1 C43.1 C44.1 C45.1 C46.1 C48.1 C49.1 C50.1 R46.1 R47.1 R49.1 R50.1 R63.1 R64.1 U4.B1(VDD) U8.8(VDDIO) U8.11(VDD) U8.20(VPP) U9.1(VDD) U10.5(VDDIO) U10.8(VDD) U11.5(VDD)
GND: C34.2 C42.2 C43.2 C44.2 C45.2 C46.2 C47.2 C48.2 C49.2 C50.2 R48.2 R82.1 U4.A1(GND) U8.2(GND) U8.3(GND) U8.4(GND) U8.5(GND) U8.7(GND) U8.14(GND) U8.15(GND) U8.16(GND) U8.17(GND) U8.22(GND) U8.25(EP) U9.3(GND) U10.6(GND) U11.2(GND)
BARO0_nCS: U9.4(~{CS}) U9.5(~{CS}) ; port BARO0_nCS
BARO1_nCS: U11.3(~{CS}) ; port BARO1_nCS
BARO_MISO: U9.6(SDO) U11.8(SDO) ; port BARO_MISO
BARO_MOSI: U9.7(SDI/SDA) U11.7(SDI/SDA) ; port BARO_MOSI
BARO_SCLK: U9.8(SCLK) U11.1(SCLK) ; port BARO_SCLK
IMU0_nCS: U8.23(NCS) ; port IMU0_nCS
IMU0_nRESET: R46.2 U8.18(RESETN) ; port IMU0_nRESET
IMU0_ODR: R47.2 U8.12(ODR) ; port IMU0_ODR
IMU1_INT1: R49.2 U10.4(INT) ; port IMU1_INT1
IMU1_INT2: R50.2 U10.9(FSYNC) ; port IMU1_INT2
IMU1_nCS: U10.12(AP_CS) ; port IMU1_nCS
IMU_MISO: U8.9(MISO) U10.1(AP_SDO) ; port IMU_MISO
IMU_MOSI: U8.1(MOSI) U10.14(AP_SDI) ; port IMU_MOSI
IMU_SCLK: U8.24(SCLK) U10.13(AP_SCLK) ; port IMU_SCLK
MAG_SCL: R64.2 U4.A2(SCL) ; port MAG_SCL
MAG_SDA: R63.2 U4.B2(SDA) ; port MAG_SDA
NetC47_1: C47.1 U8.10(REGOUT)
NetR48_1: R48.1 U11.6(PS)
NetR82_2: R82.2 U9.2(PS)

Not connected (* = marked no-connect by the designer): U8 6(FL)* 13(FL)* 19(FL)* 21(FL)*; U10 2(RESV)* 3(RESV)* 7(RESV)* 10(RESV)* 11(RESV)*; U11 4(NC)*

### Notes on the sheet
- IMU 0 (64G/2000DPS)
- COMPASS
- IMU 1 (32G/4000DPS)
- BARO0/BARO1
- (near U9) PS pulled low means SPI
- (near U11) CSB JUMPER DEFINES I2C ADDR.
  PS HIGH MEANS I2C, PS LOW MEANS SPI

### Library data of the parts
C34 C42-C50 = CMP-001-00058-1: as C3 on sheet STM32H730_PINOUT; Min Operating Temperature: -55°C; Mounting Technology: Surface Mount; Pins: 2; Case/Package: 0402; RoHS Compliant: Yes; Max Operating Temperature: 85°C
  C34 C44 C46-C50: Value: 100n
  C42 C43: Value: 10n
  C45: Value: 2.2u
R46 R47 R49 R50 R63 R64 = CMP-009-00002-14: Resistor
  R46 R49 R63 R64: Value: 100k
  R47 R50: Value: DNP
R48 R82 = CMP-009-00118-2: READ THE NAME; Pins: 2; Component Type: Standard; Design Item ID: CMP-009-00206-2; Source: 0402jump.SchLib; Value: 0402 JUMPER
U4 = CMP-010-00014-2: Magnetoresistive Sensor X, Y, Z Axis 4-WLP (0.85x0.85)
U8 = CMP-010-00029-4: 6-axis IMU with extended temperature range and high VRE performance
U9 = CMP-2000-05251-1: Barometric Pressure Sensor, with Stainless Steel Cap, 1.8 to 3.6 V, -45 to 85 degC, 8-Pin QFN, RoHS, Tape and Reel; Manufacturer: Measurement Specialties; Operating Pressure Max: 1200mbar; Supply Current: 12.5µA; Supply Voltage Max: 3.6V; Supply Voltage Min: 1.8V; No. of Pins: 8; Connection Size: 0.5mm; SVHC: NoSVHC(20-Jun-2013); Operating Pressure Min: 10mbar; Manufacturer URL: http://www.meas-spec.com/; Operating Temperature Min: -40degC; Pressure Type: Barometric; Package Reference: MS561101BA03-50-8; Datasheet URL: http://www.te.com/commerce/DocumentDelivery/DDEController?Action=srchrtrv&DocNm=MS5611-01BA03&DocType=Data+Sheet&DocLang=English&DocFormat=pdf&PartCntxt=CAT-BLPS0036; Package Description: 8-Pin Surface Mount Device, Body 5 x 3 mm, Pitch 1.25 mm; Sensor Case Style: QFN; Datasheet Version: Sep-15; Operating Temperature Max: 85degC
U10 = CMP-010-00035-1: Ultra High-Performance 6-Axis MEMS Motion Sensor
U11 = CMP-03338-000001-1: MINIATURE ALTIMETER MODULE; Manufacturer: TE Connectivity; Port Style: No Port; Min Supply Voltage: 1.8V; Response Time: 8.22ms; Sensor Output: I2C,SPI; Max Supply Voltage: 3.6V; Standoff Height: 0.1mm; Operating Supply Current: 0.9-12.5uA; Manufacturer Part Number: MS580301BA01-00; Device Class L1: Sensors; Mouser Description: MS5803-01BA Series 3 V 1 to 130 kPa Miniature Variometer Module; Temperature Range High: +85°C; Temperature: -40°C to +85°C; Category: IC; Device Class L3: unset; Device Class L2: Pressure Sensors; RoHS: TRUE; ComponentLink2Description: Datasheet; Automotive: No; Temperature Range Low: -40°C; Package: 0; Lead Free: Yes; Octopart: https://octopart.com/ms580301ba01-00-te+connectivity-59208927; Height: 3.33mm; Digikey Description: MINIATURE ALTIMETER MODULE; ComponentLink2URL: https://www.te.com/commerce/DocumentDelivery/DDEController?Action=showdoc&DocId=Data+Sheet%7FMS5803-01BA%7FB3%7Fpdf%7FEnglish%7FENG_DS_MS5803-01BA_B3.pdf%7FMS580301BA01-00

## Sheet GPS.SchDoc
size B; SheetNumber: 5; SheetTotal: 9
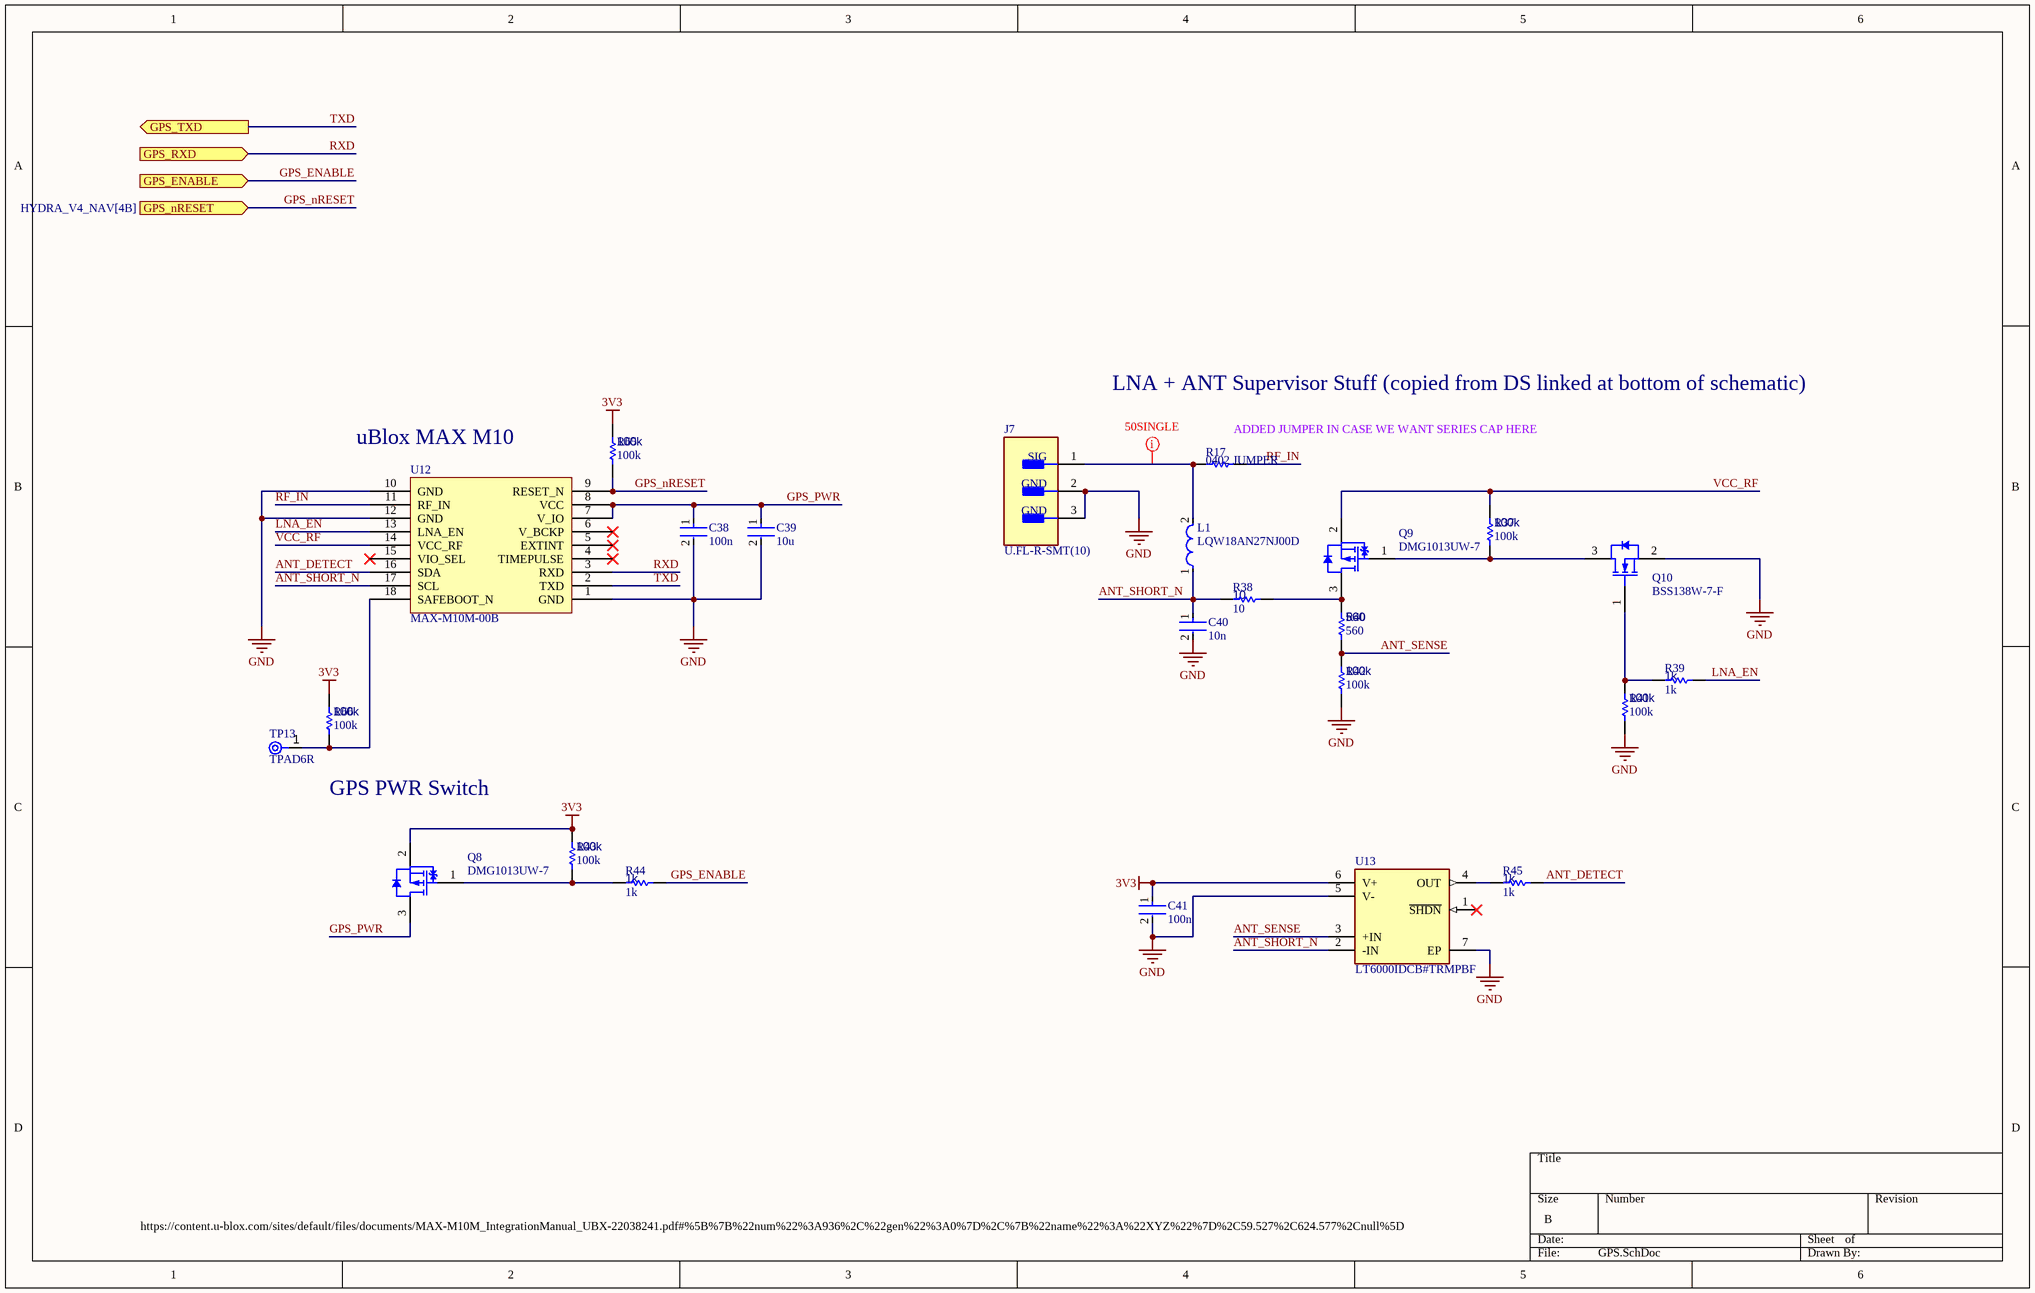
[diagram p4: GPS.SchDoc]

### Parts
C38  100n  [FP-0402-L_1_0_0_05-W_0_5-IPC_A]
C39  10u  [FP-0402-L_1_0_0_05-W_0_5-IPC_A]
C40  10n  [FP-0402-L_1_0_0_05-W_0_5-IPC_A]
C41  100n  [FP-0402-L_1_0_0_05-W_0_5-IPC_A]
J7  U.FL-R-SMT(10)  [FP-U_FL-R-SMT_10-MFG]
L1  LQW18AN27NJ00D  [FP-LQW18AN_00-MFG]
Q8  DMG1013UW-7  [DIOD-SOT323-3_V]
Q9  DMG1013UW-7  [DIOD-SOT323-3_V]
Q10  BSS138W-7-F  [DIOD-SOT323-3_V]
R17  0402 JUMPER  [RESC1005X40X25ML05T05]
R37  100k  [R0603B]
R38  10  [R0603B]
R39  1k  [R0603B]
R40  560  [R0603B]
R41  100k  [R0603B]
R42  100k  [R0603B]
R43  100k  [R0603B]
R44  1k  [R0603B]
R45  1k  [R0603B]
R65  100k  [R0603B]
R66  100k  [R0603B]
TP13  TPAD6R  [New footprint 1]
U12  MAX-M10M-00B  [MAX-M10M-00B-Footprint-1]
U13  LT6000IDCB#TRMPBF  [FP-DCB-6-05-08-1715-MFG]

### Ports
GPS_ENABLE (in, see HYDRA_V4_NAV[4B]), GPS_nRESET (in, see HYDRA_V4_NAV[4B]), GPS_RXD (in, see HYDRA_V4_NAV[4B]), GPS_TXD (out, see HYDRA_V4_NAV[4B])

### Nets
3V3: C41.1 Q8.2(S) R43.1 R65.1 R66.1 U13.6(V+)
GND: C38.2 C39.2 C40.2 C41.2 J7.2(GND) J7.3(GND) Q10.2(S) R41.2 R42.2 U12.1(GND) U12.10(GND) U12.12(GND) U13.5(V-) U13.7(EP)
ANT_DETECT: R45.2 U12.16(SDA)
ANT_SENSE: R40.2 R42.1 U13.3(+IN)
ANT_SHORT_N: C40.1 L1.1 R38.1 U12.17(SCL) U13.2(-IN)
GPS_ENABLE: R44.2 ; port GPS_ENABLE
GPS_nRESET: R65.2 U12.9(RESET_N) ; port GPS_nRESET
GPS_PWR: C38.1 C39.1 Q8.3(D) U12.7(V_IO) U12.8(VCC)
LNA_EN: R39.2 U12.13(LNA_EN)
RF_IN: R17.2 U12.11(RF_IN)
RXD: U12.3(RXD) ; port GPS_RXD
TXD: U12.2(TXD) ; port GPS_TXD
VCC_RF: Q9.2(S) R37.1 U12.14(VCC_RF)
NetJ7_1: J7.1(SIG) L1.2 R17.1
NetQ8_1: Q8.1(G) R43.2 R44.1
NetQ9_1: Q9.1(G) Q10.3(D) R37.2
NetQ9_3: Q9.3(D) R38.2 R40.1
NetQ10_1: Q10.1(G) R39.1 R41.1
NetR45_1: R45.1 U13.4(OUT)
NetR66_2: R66.2 TP13.1(TP) U12.18(SAFEBOOT_N)

Not connected (* = marked no-connect by the designer): U12 4(TIMEPULSE)* 5(EXTINT)* 6(V_BCKP)* 15(VIO_SEL)*; U13 1(~{SHDN})*

### Layout directives
net class 50SINGLE: NetJ7_1

### Notes on the sheet
- LNA + ANT Supervisor Stuff (copied from DS linked at bottom of schematic)
- (near R17) ADDED JUMPER IN CASE WE WANT SERIES CAP HERE
- (near U12) uBlox MAX M10
- GPS PWR Switch
- https://content.u-blox.com/sites/default/files/documents/MAX-M10M_IntegrationManual_UBX-22038241.pdf#%5B%7B%22num%22%3A936%2C%22gen%22%3A0%7D%2C%7B%22name%22%3A%22XYZ%22%7D%2C59.527%2C624.577%2Cnull%5D

### Library data of the parts
C38-C41 = CMP-001-00058-1: as C3 on sheet STM32H730_PINOUT; Min Operating Temperature: -55°C; Mounting Technology: Surface Mount; Pins: 2; Case/Package: 0402; RoHS Compliant: Yes; Max Operating Temperature: 85°C
  C38 C41: Value: 100n
  C39: Value: 10u
  C40: Value: 10n
J7 = CMP-0029-00003-2: CONN U.FL RCPT STR 50 OHM SMD; Plating: Silver; Connector Type: Coaxial; Frequency: 6GHz; Impedance: 50R; Body Material: Bronze; Dielectric Material: Polymer; Contact Plating: Gold; Termination: Solder; Orientation: Vertical; Contact Material: Brass; Min Operating Temperature: -40°C; Mount: Surface Mount; Lead Free: Lead Free; Max Operating Temperature: 90°C; Radiation Hardening: No; Packaging: Tape and Reel; Body Plating: Silver; Fastening Type: Snap; Max Frequency: 6GHz; Depth: 3.1mm; Package Quantity: 1; Case/Package: SMD/SMT; Housing Color: Beige; Length: 3mm
L1 = CMP-06042-013840-1: Wire Wound RF Inductor 27nH ±5% 440mA 0.21Ω 0603 (1608); Shielding: Unshielded; Test Frequency: 100MHz; Q Factor: 40; Self Resonant Frequency: 3.7GHz; DC Resistance (DCR): 210mR; Core Material: Non-Magnetic; Depth: 1mm; Min Operating Temperature: -55°C; Package Quantity: 4000; Inductance: 27nH; Case Code (Metric): 1608; Height - Seated (Max): 0.039inch; Resistor Type: Wirewound; Max DC Current: 440mA; Tolerance: 5%; Length: 1.6mm; Mount: Surface Mount; DC Current: 440mA; Packaging: Tape and Reel; Lead Free: Lead Free; Case Code (Imperial): 0603; Current Rating: 440mA; Width: 0.8mm; Max Operating Temperature: 125°C; Termination: SMD/SMT; Weight: 0.000106oz; Radiation Hardening: No; Height: 0.8mm; Case/Package: 0603; Military Standard: Not
Q8 Q9 = CMP-2000-06170-1: P-Channel Enhancement Mode MOSFET, 310 mW, 20 V, -55 to 150 degC, 3-Pin SOT-323, RoHS, Tape and Reel; Manufacturer: Diodes Inc; Qg Gate Charge: 0.622nC; Drain-Source On Resistance-Max: 750mO; Rated Power Dissipation: 310mW; Drain-to-Source Voltage [Vdss]: 20V; Package Reference: SOT323; Datasheet Version: Rev. 3-2, 09/2013; Package Description: 3-Pin Small Outline Transistor, Body 2 x 1.25 mm, Pitch 0.65 mm; Mounting Technology: SurfaceMount; Manufacturer URL: http://www.diodes.com/; Datasheet URL: http://www.diodes.com/_files/datasheets/ds31861.pdf; Channel Type: P-Channel
Q10 = CMP-2000-05968-1: N-Channel Enhancement Mode Mosfet, 50 V, 200 mA, -55 to 150 degC, 6-Pin SOT-323, RoHS, Tape and Reel; Typical Turn-Off Delay Time: 20ns; Number of Channels: 1Channel; Type: EnhancementModeFieldEffectTransistor; Brand: DiodesIncorporated; Vds - Drain-Source Breakdown Voltage: 75V; Vgs - Gate-Source Voltage: 20V; Rds On - Drain-Source Resistance: 1.4Ohms; Transistor Type: 1N-Channel; Configuration: Single; Unit Weight: 0.000212oz; Pd - Power Dissipation: 200mW; Id - Continuous Drain Current: 200mA; Forward Transconductance - Min: 0.1S; Manufacturer URL: http://www.diodes.com/; Series: BSS138; Package Description: 3-Pin Small Outline Transistor, Body 2 x 1.25 mm, Pitch 0.65 mm; Mounting Technology: SurfaceMount; Product Category: MOSFET; RoHS: True; Maximum Operating Temperature: +150C; Height: 1mm; Length: 2.2mm; Technology: Si; Width: 1.35mm; Datasheet URL: http://www.diodes.com/_files/datasheets/ds30206.pdf; Manufacturer: DiodesIncorporated; Package / Case: SOT-323-3; Typical Turn-On Delay Time: 20ns; Transistor Polarity: N-Channel; Factory Pack Quantity: 3000; Packaging: Reel; Product: MOSFETSmallSignal; Datasheet Version: Rev. 11-2, 09/2013; Package Reference: SOT323; Minimum Operating Temperature: -55C; Mounting Style: SMD/SMT; Channel Mode: Enhancement
R17 = CMP-009-00118-2: READ THE NAME; Pins: 2; Component Type: Standard; Design Item ID: CMP-009-00206-2; Source: 0402jump.SchLib; Value: 0402 JUMPER
R37-R45 R65 R66 = CMP-009-00002-14: Resistor
  R37 R41-R43 R65 R66: Value: 100k
  R38: Value: 10
  R39 R44 R45: Value: 1k
  R40: Value: 560
TP13 = CMP-00025-2: Test Point .6mm
U12 = CMP-010-00031-2: Gnss Lcc Rx Mod, Rom, Crystal
U13 = CMP-09116-000039-1: IC OPAMP GP 1 CIRCUIT 6DFN; Number of Elements: 1; Power Supply Rejection Ratio (PSRR): 86dB; Output Current per Channel: 10mA; Gain Bandwidth Product: 60kHz; Operating Supply Current: 20uA; Input Bias Current: 12nA; Voltage Gain: 120dB; Max Supply Voltage: 18V; Input Offset Voltage (Vos): 1.2mV; Min Supply Voltage: 1.8V; Slew Rate: 0.018V/µs; Common Mode Rejection Ratio: 68dB; Packaging: Tape and Reel; Mount: Surface Mount; Case/Package: DFN; Max Operating Temperature: 85°C; Number of Pins: 6; Number of Amplifiers: 1; REACH SVHC: No SVHC; Unity Gain Bandwidth Product: 60kHz; Bandwidth: 60kHz; Lead Free: Lead Free; Number of Circuits: 1; Min Operating Temperature: -40°C; Package Quantity: 1

## Sheet SD.SchDoc
size A; SheetNumber: 4; SheetTotal: 9
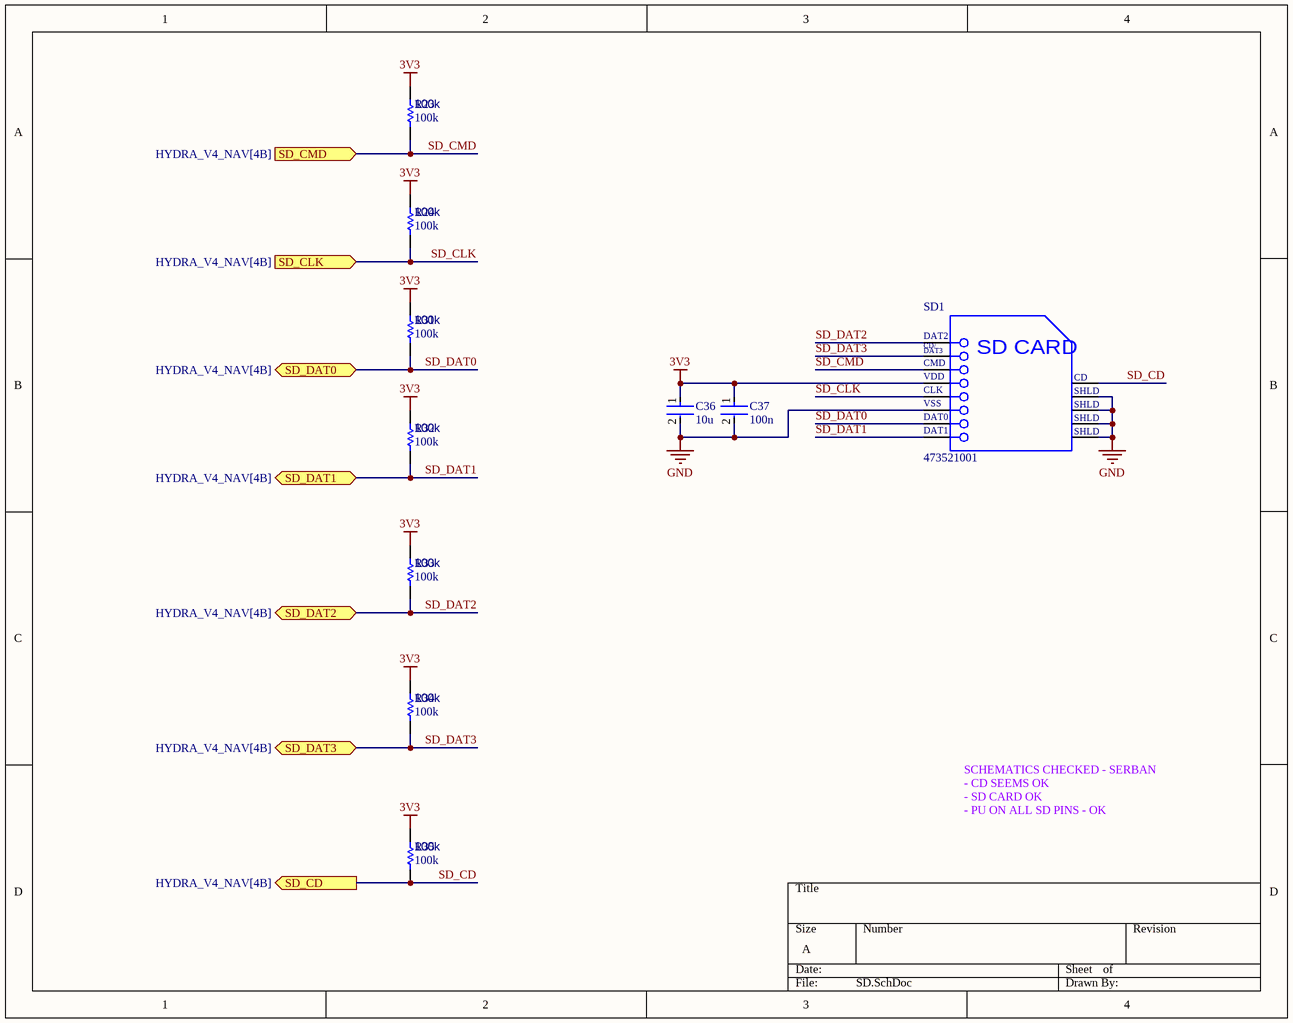
[diagram p5: SD.SchDoc]

### Parts
C36  10u  [FP-0402-L_1_0_0_05-W_0_5-IPC_A]
C37  100n  [FP-0402-L_1_0_0_05-W_0_5-IPC_A]
R23  100k  [R0603B]
R24  100k  [R0603B]
R31  100k  [R0603B]
R32  100k  [R0603B]
R33  100k  [R0603B]
R34  100k  [R0603B]
R35  100k  [R0603B]
SD1  473521001  [MOLX-473521001_V]

### Ports
SD_CD (out, see HYDRA_V4_NAV[4B]), SD_CLK (in, see HYDRA_V4_NAV[4B]), SD_CMD (in, see HYDRA_V4_NAV[4B]), SD_DAT0 (bidir, see HYDRA_V4_NAV[4B]), SD_DAT1 (bidir, see HYDRA_V4_NAV[4B]), SD_DAT2 (bidir, see HYDRA_V4_NAV[4B]), SD_DAT3 (bidir, see HYDRA_V4_NAV[4B])

### Nets
3V3: C36.1 C37.1 R23.1 R24.1 R31.1 R32.1 R33.1 R34.1 R35.1 SD1.4(VDD)
GND: C36.2 C37.2 SD1.6(VSS) SD1.10(SHLD) SD1.11(SHLD) SD1.12(SHLD) SD1.13(SHLD)
SD_CD: R35.2 SD1.9(CD) ; port SD_CD
SD_CLK: R24.2 SD1.5(CLK) ; port SD_CLK
SD_CMD: R23.2 SD1.3(CMD) ; port SD_CMD
SD_DAT0: R31.2 SD1.7(DAT0) ; port SD_DAT0
SD_DAT1: R32.2 SD1.8(DAT1) ; port SD_DAT1
SD_DAT2: R33.2 SD1.1(DAT2) ; port SD_DAT2
SD_DAT3: R34.2 SD1.2(CD/DAT3) ; port SD_DAT3

### Notes on the sheet
- SCHEMATICS CHECKED - SERBAN
  - CD SEEMS OK
  - SD CARD OK
  - PU ON ALL SD PINS - OK
- (in symbol CMP-2000-05848-1) CD/; DAT3; SD CARD

### Library data of the parts
C36 C37 = CMP-001-00058-1: as C3 on sheet STM32H730_PINOUT; Min Operating Temperature: -55°C; Mounting Technology: Surface Mount; Pins: 2; Case/Package: 0402; RoHS Compliant: Yes; Max Operating Temperature: 85°C
  C36: Value: 10u
  C37: Value: 100n
R23 R24 R31-R35 = CMP-009-00002-14: Resistor; Value: 100k
SD1 = CMP-2000-05848-1: MicroSD(TM), Pitch 1.1 mm, 8 Position, Height 1.88 mm, -20 to 85 degC, RoHS, Tape and Reel; Manufacturer: Molex; Datasheet Version: Rev. G, 01/2012; Datasheet URL: http://www.molex.com/pdm_docs/sd/473521001_sd.pdf; Package Reference: 473521001; Manufacturer URL: http://www.molex.com/; Mounting Technology: SurfaceMount; Package Description: MicroSD(TM), Pitch 1.1 mm, 8 Position, Height 1.88 mm

## Sheet OC_PROT.SchDoc
size C; SheetNumber: 2; SheetTotal: 9
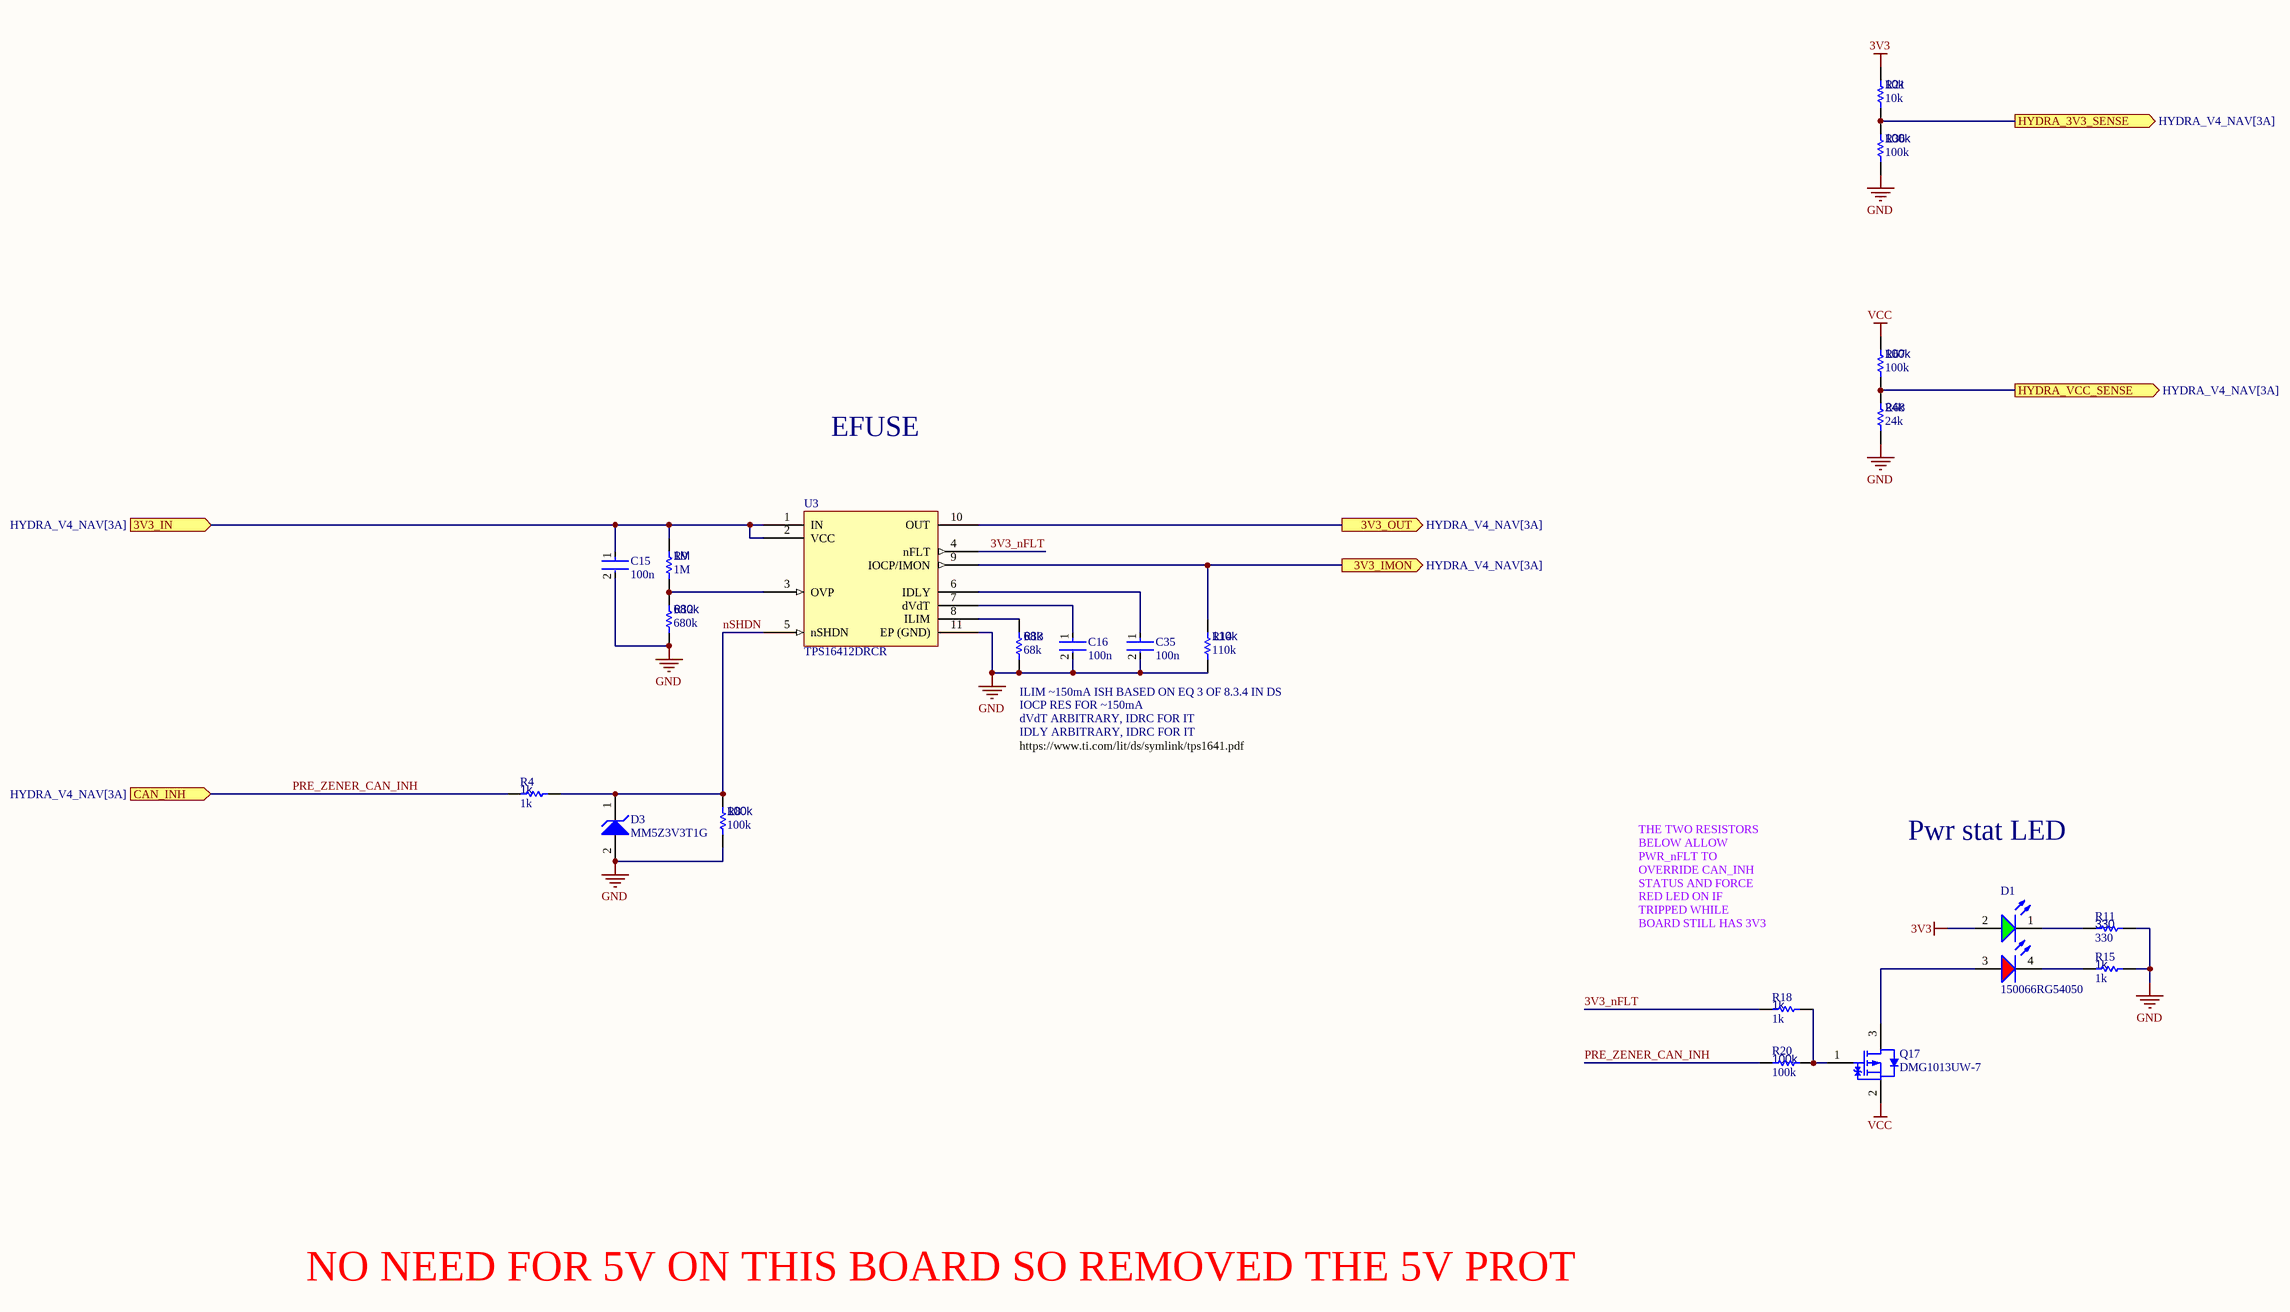
[diagram p6: OC_PROT.SchDoc]

### Parts
C15  100n  [FP-0402-L_1_0_0_05-W_0_5-IPC_A]
C16  100n  [FP-0402-L_1_0_0_05-W_0_5-IPC_A]
C35  100n  [FP-0402-L_1_0_0_05-W_0_5-IPC_A]
D1  150066RG54050  [WL-SBCD_0606]
D3  MM5Z3V3T1G  [ONSC-SOD-523-2-502-01_V]
Q17  DMG1013UW-7  [DIOD-SOT323-3_V]
R4  1k  [R0603B]
R8  100k  [R0603B]
R9  1M  [R0603B]
R11  330  [R0603B]
R12  680k  [R0603B]
R13  68k  [R0603B]
R14  110k  [R0603B]
R15  1k  [R0603B]
R18  1k  [R0603B]
R20  100k  [R0603B]
R21  10k  [R0603B]
R36  100k  [R0603B]
R67  100k  [R0603B]
R68  24k  [R0603B]
U3  TPS16412DRCR  [PSON50P300X100_HS-11N]

### Ports
3V3_IMON (out, see HYDRA_V4_NAV[3A]), 3V3_IN (in, see HYDRA_V4_NAV[3A]), 3V3_OUT (out, see HYDRA_V4_NAV[3A]), CAN_INH (in, see HYDRA_V4_NAV[3A]), HYDRA_3V3_SENSE (out, see HYDRA_V4_NAV[3A]), HYDRA_VCC_SENSE (out, see HYDRA_V4_NAV[3A])

### Nets
3V3: D1.2(A) R21.1 U3.10(OUT) ; port 3V3_OUT
GND: C15.2 C16.2 C35.2 D3.2(A) R8.1 R11.1 R12.2 R13.2 R14.2 R15.1 R36.2 R68.2 U3.11(EP_(GND))
VCC: Q17.2(S) R67.1  [project net TCAN1146_VSUP]
3V3_nFLT: R18.2 U3.4(nFLT)
nSHDN: D3.1(K) R4.1 R8.2 U3.5(nSHDN)
PRE_3V3: C15.1 R9.1 U3.1(IN) U3.2(VCC) ; port 3V3_IN
PRE_ZENER_CAN_INH: R4.2 R20.2 ; port CAN_INH
NetC16_1: C16.1 U3.7(dVdT)
NetC35_1: C35.1 U3.6(IDLY)
NetD1_1: D1.1(K) R11.2
NetD1_3: D1.3(A) Q17.3(D)
NetD1_4: D1.4(K) R15.2
NetQ17_1: Q17.1(G) R18.1 R20.1
NetR9_2: R9.2 R12.1 U3.3(OVP)
NetR13_1: R13.1 U3.8(ILIM)
NetR14_1: R14.1 U3.9(IOCP/IMON) ; port 3V3_IMON
NetR21_2: R21.2 R36.1 ; port HYDRA_3V3_SENSE
NetR67_2: R67.2 R68.1 ; port HYDRA_VCC_SENSE

### Notes on the sheet
- EFUSE
- ILIM ~150mA ISH BASED ON EQ 3 OF 8.3.4 IN DS
- dVdT ARBITRARY, IDRC FOR IT
- IOCP RES FOR ~150mA
- https://www.ti.com/lit/ds/symlink/tps1641.pdf
- IDLY ARBITRARY, IDRC FOR IT
- Pwr stat LED
- THE TWO RESISTORS BELOW ALLOW PWR_nFLT TO OVERRIDE CAN_INH STATUS AND FORCE RED LED ON IF TRIPPED WHILE BOARD STILL HAS 3V3
- NO NEED FOR 5V ON THIS BOARD SO REMOVED THE 5V PROT

### Library data of the parts
C15 C16 = CMP-001-00058-1: as C3 on sheet STM32H730_PINOUT; Value: 100n; Min Operating Temperature: -55°C; Mounting Technology: Surface Mount; Pins: 2; Case/Package: 0402; RoHS Compliant: Yes; Max Operating Temperature: 85°C
C35 = CMP-001-00058-1: LARGE PADS, 0402 CAP, CHANGE COMMENT TO MATCH REAL P/N; Capacitor Type: Ceramic; Value: TBD; Min Operating Temperature: -55°C; Mounting Technology: Surface Mount; Pins: 2; Case/Package: 0402; RoHS Compliant: Yes; Max Operating Temperature: 85°C
D1 = CMP-004-00040-2: as D2 on sheet HYDRA_V4_NAV; Source: rgled.SchLib; Component Type: Standard; Design Item ID: CMP-004-00034-2; Pins: 4
D3 = CMP-1060-00750-1: Zener Voltage Regulator, 500 mW, 2-Pin SOD-523, Pb-Free, Tape and Reel; Manufacturer: On Semiconductor; P Max (W): 0.5; VZ Typ (V): 3.3; RoHS: Pb-Free; ComponentLink2Description: Datasheet; PackageReference: SOD-523-2-502-01; DatasheetVersion: Rev. 10; ComponentLink1Description: Manufacturer URL; PackageVersion: Rev. E, 09/2010; ComponentLink3URL: http://www.onsemi.com/pub_link/Collateral/502-01.PDF; ComponentLink2URL: http://www.onsemi.cn/pub_link/Collateral/MM5Z2V4T1-D.PDF; Mounting Technology: Surface Mount; PartNumber: MM5Z3V3T1G; Packing: Tape and Reel; PackageDescription: 2-Pin SOD, Body 1.2 x 0.8 mm; ComponentLink1URL: http://www.onsemi.com/; ComponentLink3Description: Package Specification
Q17 = CMP-2000-06170-1: as Q8 on sheet GPS; Package Reference: SOT323; Datasheet Version: Rev. 3-2, 09/2013; Package Description: 3-Pin Small Outline Transistor, Body 2 x 1.25 mm, Pitch 0.65 mm; Mounting Technology: SurfaceMount; Manufacturer URL: http://www.diodes.com/; Datasheet URL: http://www.diodes.com/_files/datasheets/ds31861.pdf; Channel Type: P-Channel
R4 R8 R9 R11-R15 R18 R20 R21 R36 R67 R68 = CMP-009-00002-14: Resistor
  R4 R15 R18: Value: 1k
  R8 R20 R36 R67: Value: 100k
  R9: Value: 1M
  R11: Value: 330
  R12: Value: 680k
  R13: Value: 68k
  R14: Value: 110k
  R21: Value: 10k
  R68: Value: 24k
U3 = CMP-019-00048-3: 2.7-V to 40-V 152-mΩ 1.8-A eFuse with output power limiting 10-VSON -40 to 125

## Sheet ACTUATOR_PWR_PROT.SchDoc
size B; SheetNumber: 7; SheetTotal: 9
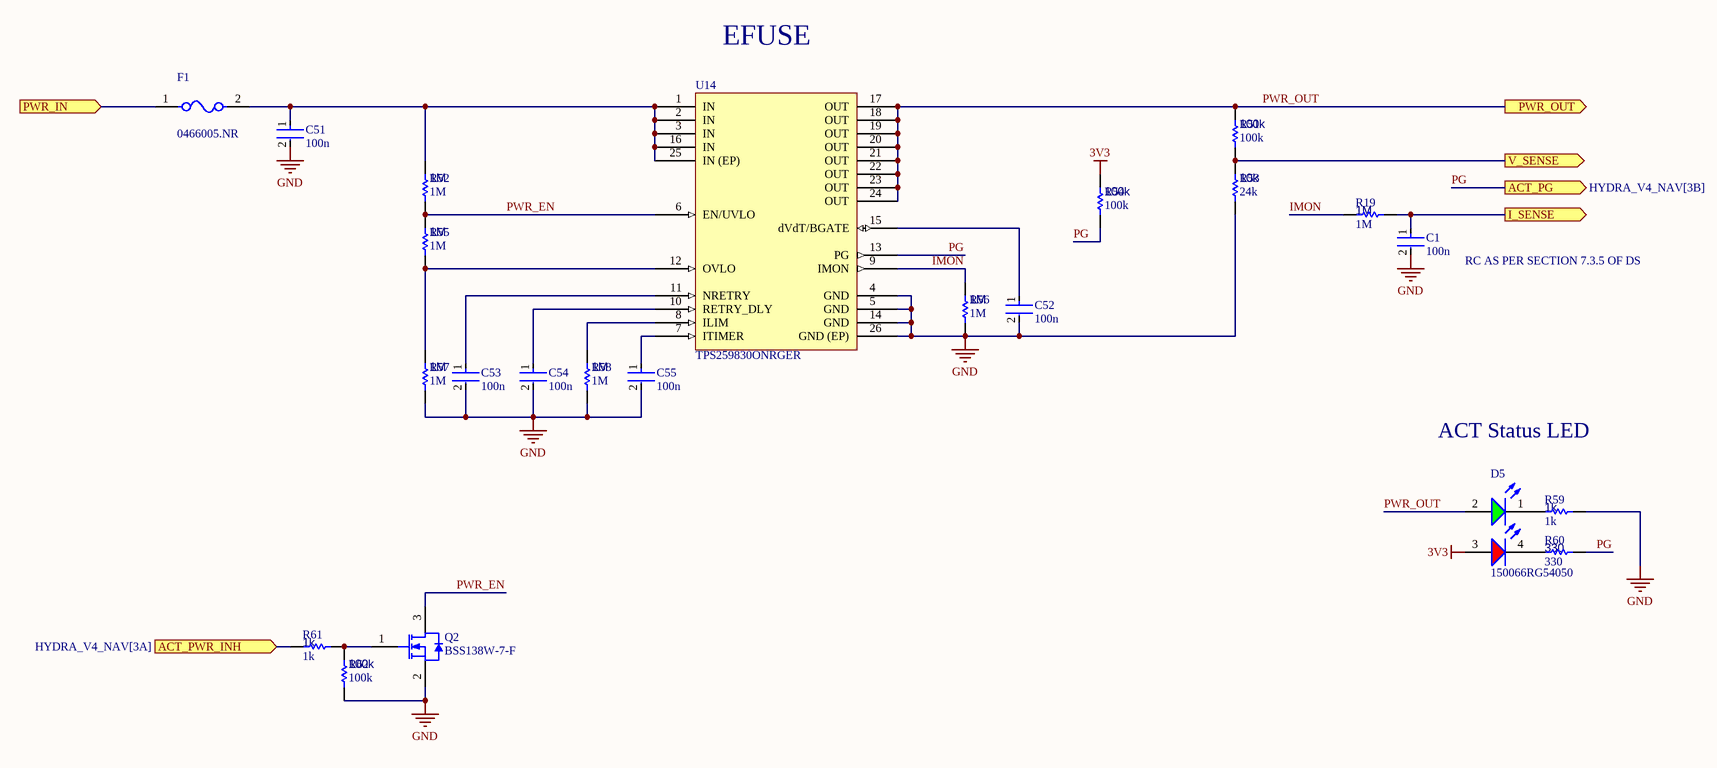
[diagram p7: ACTUATOR_PWR_PROT.SchDoc]

### Parts
C1  100n  [FP-0402-L_1_0_0_05-W_0_5-IPC_A]
C51  100n  [FP-0402-L_1_0_0_05-W_0_5-IPC_A]
C52  100n  [FP-0402-L_1_0_0_05-W_0_5-IPC_A]
C53  100n  [FP-0402-L_1_0_0_05-W_0_5-IPC_A]
C54  100n  [FP-0402-L_1_0_0_05-W_0_5-IPC_A]
C55  100n  [FP-0402-L_1_0_0_05-W_0_5-IPC_A]
D5  150066RG54050  [WL-SBCD_0606]
F1  0466005.NR  [FP-0466-MFG]
Q2  BSS138W-7-F  [DIOD-SOT323-3_V]
R19  1M  [R0603B]
R51  100k  [R0603B]
R52  1M  [R0603B]
R53  24k  value 10k  [R0603B]
R54  100k  [R0603B]
R55  1M  [R0603B]
R56  1M  [R0603B]
R57  1M  [R0603B]
R58  1M  [R0603B]
R59  1k  [R0603B]
R60  330  [R0603B]
R61  1k  [R0603B]
R62  100k  [R0603B]
U14  TPS259830ONRGER  [QFN50P400X400X100_HS-25N]

### Ports
ACT_PG (out, see HYDRA_V4_NAV[3B]), ACT_PWR_INH (in, see HYDRA_V4_NAV[3A]), I_SENSE (out, see HYDRA_V4_NAV[3A]), PWR_IN (in, see HYDRA_V4_NAV[3A]), PWR_OUT (out, see HYDRA_V4_NAV[3A]), V_SENSE (out, see HYDRA_V4_NAV[3A])

### Nets
3V3: D5.3(A) R54.1
GND: C1.2 C51.2 C52.2 C53.2 C54.2 C55.2 Q2.2(S) R53.2 R56.2 R57.2 R58.2 R59.2 R62.2 U14.4(GND) U14.5(GND) U14.14(GND) U14.26(GND_(EP))
IMON: R19.1 R56.1 U14.9(IMON)
PG: R54.2 R60.2 U14.13(PG) ; port ACT_PG
PWR_EN: Q2.3(D) R52.2 R55.1 U14.6(EN/UVLO)
PWR_OUT: D5.2(A) R51.1 U14.17(OUT) U14.18(OUT) U14.19(OUT) U14.20(OUT) U14.21(OUT) U14.22(OUT) U14.23(OUT) U14.24(OUT) ; port PWR_OUT  [project net ACT_PWR]
PYRO_PWR: F1.1 ; port PWR_IN
NetC1_1: C1.1 R19.2 ; port I_SENSE
NetC51_1: C51.1 F1.2 R52.1 U14.1(IN) U14.2(IN) U14.3(IN) U14.16(IN) U14.25(IN_(EP))
NetC52_1: C52.1 U14.15(dVdT/BGATE)
NetC53_1: C53.1 U14.11(NRETRY)
NetC54_1: C54.1 U14.10(RETRY_DLY)
NetC55_1: C55.1 U14.7(ITIMER)
NetD5_1: D5.1(K) R59.1
NetD5_4: D5.4(K) R60.1
NetQ2_1: Q2.1(G) R61.2 R62.1
NetR51_2: R51.2 R53.1 ; port V_SENSE
NetR55_2: R55.2 R57.1 U14.12(OVLO)
NetR58_1: R58.1 U14.8(ILIM)
NetR61_1: R61.1 ; port ACT_PWR_INH

### Notes on the sheet
- EFUSE
- RC AS PER SECTION 7.3.5 OF DS
- ACT Status LED

### Library data of the parts
C1 C51-C55 = CMP-001-00058-1: as C3 on sheet STM32H730_PINOUT; Value: 100n; Min Operating Temperature: -55°C; Mounting Technology: Surface Mount; Pins: 2; Case/Package: 0402; RoHS Compliant: Yes; Max Operating Temperature: 85°C
D5 = CMP-004-00040-2: as D2 on sheet HYDRA_V4_NAV; Source: rgled.SchLib; Component Type: Standard; Design Item ID: CMP-004-00034-2; Pins: 4
F1 = CMP-08605-000032-1: FUSE BOARD MNT 5A 32VAC/VDC 1206; Manufacturer: Littelfuse Inc; Value: 0.011Ω; Max Fuse Ac Voltage: 32V; Fuse I2T: 2.5A2Sec; Fuse Interrupt Ac Current: 50A; Fuse Blow Speed: Fast; Fuse Voltage Drop: 73.75mV; Category: Fuse; Temperature: -55°C to +90°C; Lead Free: Yes; Temperature Range High: +90°C; RoHS: TRUE; Device Class L2: Fuses; ComponentLink2URL: https://www.littelfuse.com/~/media/electronics/datasheets/fuses/littelfuse_fuse_466_datasheet.pdf.pdf; Fuse Current: 5A; Octopart: https://octopart.com/0466005.nr-littelfuse-143206; Automotive: No; Max Fuse Dc Voltage: 32V; Temperature Range Low: -55°C; Device Class L3: unset; ComponentLink2Description: Datasheet; Manufacturer Part Number: 0466005.NR; Fuse Interrupt Dc Current: 50A; Resistance: 0.011Ω; Package: 0466; Device Class L1: Circuit Protection; Mouser Description: Surface Mount Fuses 32V 5A VFA Slimline; Height: 0.66mm; Voltage Rating: 32V; Digikey Description: FUSE BOARD MNT 5A 32VAC/VDC 1206
Q2 = CMP-2000-05968-1: as Q10 on sheet GPS; Manufacturer URL: http://www.diodes.com/; Series: BSS138; Package Description: 3-Pin Small Outline Transistor, Body 2 x 1.25 mm, Pitch 0.65 mm; Mounting Technology: SurfaceMount; Product Category: MOSFET; RoHS: True; Maximum Operating Temperature: +150C; Height: 1mm; Length: 2.2mm; Technology: Si; Width: 1.35mm; Datasheet URL: http://www.diodes.com/_files/datasheets/ds30206.pdf; Manufacturer: DiodesIncorporated; Package / Case: SOT-323-3; Typical Turn-On Delay Time: 20ns; Transistor Polarity: N-Channel; Factory Pack Quantity: 3000; Packaging: Reel; Product: MOSFETSmallSignal; Datasheet Version: Rev. 11-2, 09/2013; Package Reference: SOT323; Minimum Operating Temperature: -55C; Mounting Style: SMD/SMT; Channel Mode: Enhancement
R19 R51-R62 = CMP-009-00002-14: Resistor
  R19 R52 R55-R58: Value: 1M
  R51 R54 R62: Value: 100k
  R59 R61: Value: 1k
  R60: Value: 330
U14 = CMP-019-00050-3: 2.7-V to 26-V, 2.7-mΩ 18-A integrated hot-swap eFuse with current monitor and blocking FET driver 24-VQFN -40 to 125

## Sheet TCAN330_PINOUT.SchDoc
size A4; SheetNumber: 8; SheetTotal: 9
Used 2 times, as channels FDCAN_1, FDCAN_2. Parts and nets are listed once, with the designators drawn on the sheet.
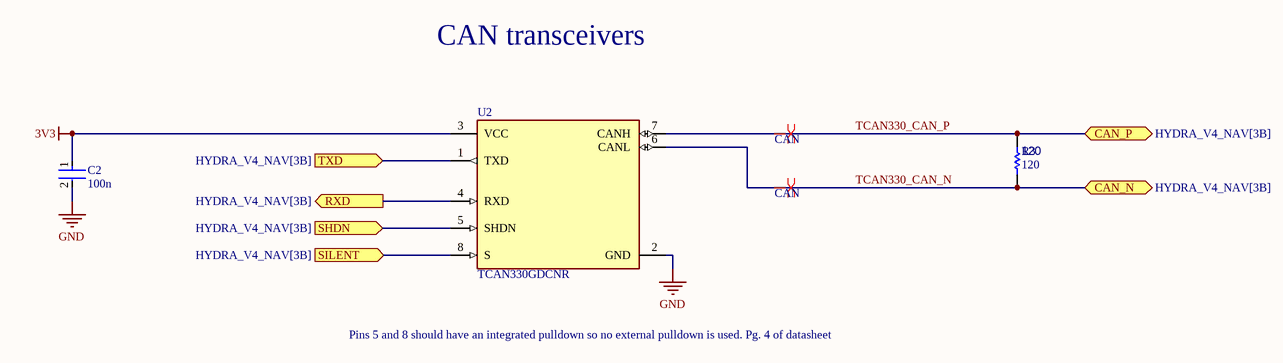
[diagram p8: TCAN330_PINOUT.SchDoc]

### Parts
C2  100n  [FP-0402-L_1_0_0_05-W_0_5-IPC_A]
R3  120  [R0603B]
U2  TCAN330GDCNR  [FP-DCN0008A-MFG]

### Ports
CAN_N (bidir, see HYDRA_V4_NAV[3B]), CAN_P (bidir, see HYDRA_V4_NAV[3B]), RXD (out, see HYDRA_V4_NAV[3B]), SHDN (in, see HYDRA_V4_NAV[3B]), SILENT (in, see HYDRA_V4_NAV[3B]), TXD (in, see HYDRA_V4_NAV[3B])

### Nets
3V3: C2.1 U2.3(VCC)
GND: C2.2 U2.2(GND)
RXD: U2.4(RXD) ; port RXD
SHDN: U2.5(SHDN) ; port SHDN
SILENT: U2.8(S) ; port SILENT
TCAN330_CAN_N: R3.1 U2.6(CANL) ; port CAN_N
TCAN330_CAN_P: R3.2 U2.7(CANH) ; port CAN_P
TXD: U2.1(TXD) ; port TXD

### Channels
FDCAN_1: designators end in _FDCAN_1; ports CAN_N=CAN1_N CAN_P=CAN1_P RXD=NetU1_70 SHDN=NetU2_FDCAN_1_5 SILENT=NetU2_FDCAN_1_8 TXD=NetU1_71
FDCAN_2: designators end in _FDCAN_2; ports CAN_N=CAN2_N CAN_P=CAN2_P RXD=NetU1_91 SHDN=NetU2_FDCAN_2_5 SILENT=NetU2_FDCAN_2_8 TXD=NetU1_92

### Layout directives
differential pair; net class CAN: CAN1_N, CAN1_P

### Notes on the sheet
- CAN transceivers
- Pins 5 and 8 should have an integrated pulldown so no external pulldown is used. Pg. 4 of datasheet

### Library data of the parts
C2 = CMP-001-00058-1: as C3 on sheet STM32H730_PINOUT; Value: 100n; Min Operating Temperature: -55°C; Mounting Technology: Surface Mount; Pins: 2; Case/Package: 0402; RoHS Compliant: Yes; Max Operating Temperature: 85°C
R3 = CMP-009-00002-14: Resistor; Value: 120
U2 = CMP-04872-000178-1: IC TRANSCEIVER 1/1 SOT23-8; Data Rate: 1Mbps; Packaging: Tape and Reel; Min Operating Temperature: -40°C; Max Operating Temperature: 125°C; RoHS Compliant: Yes; Lead Free: Lead Free; Case/Package: SOT-23-8; Mount: Surface Mount

## Sheet TCAN1146_PINOUT.SchDoc
size A4; SheetNumber: 9; SheetTotal: 9
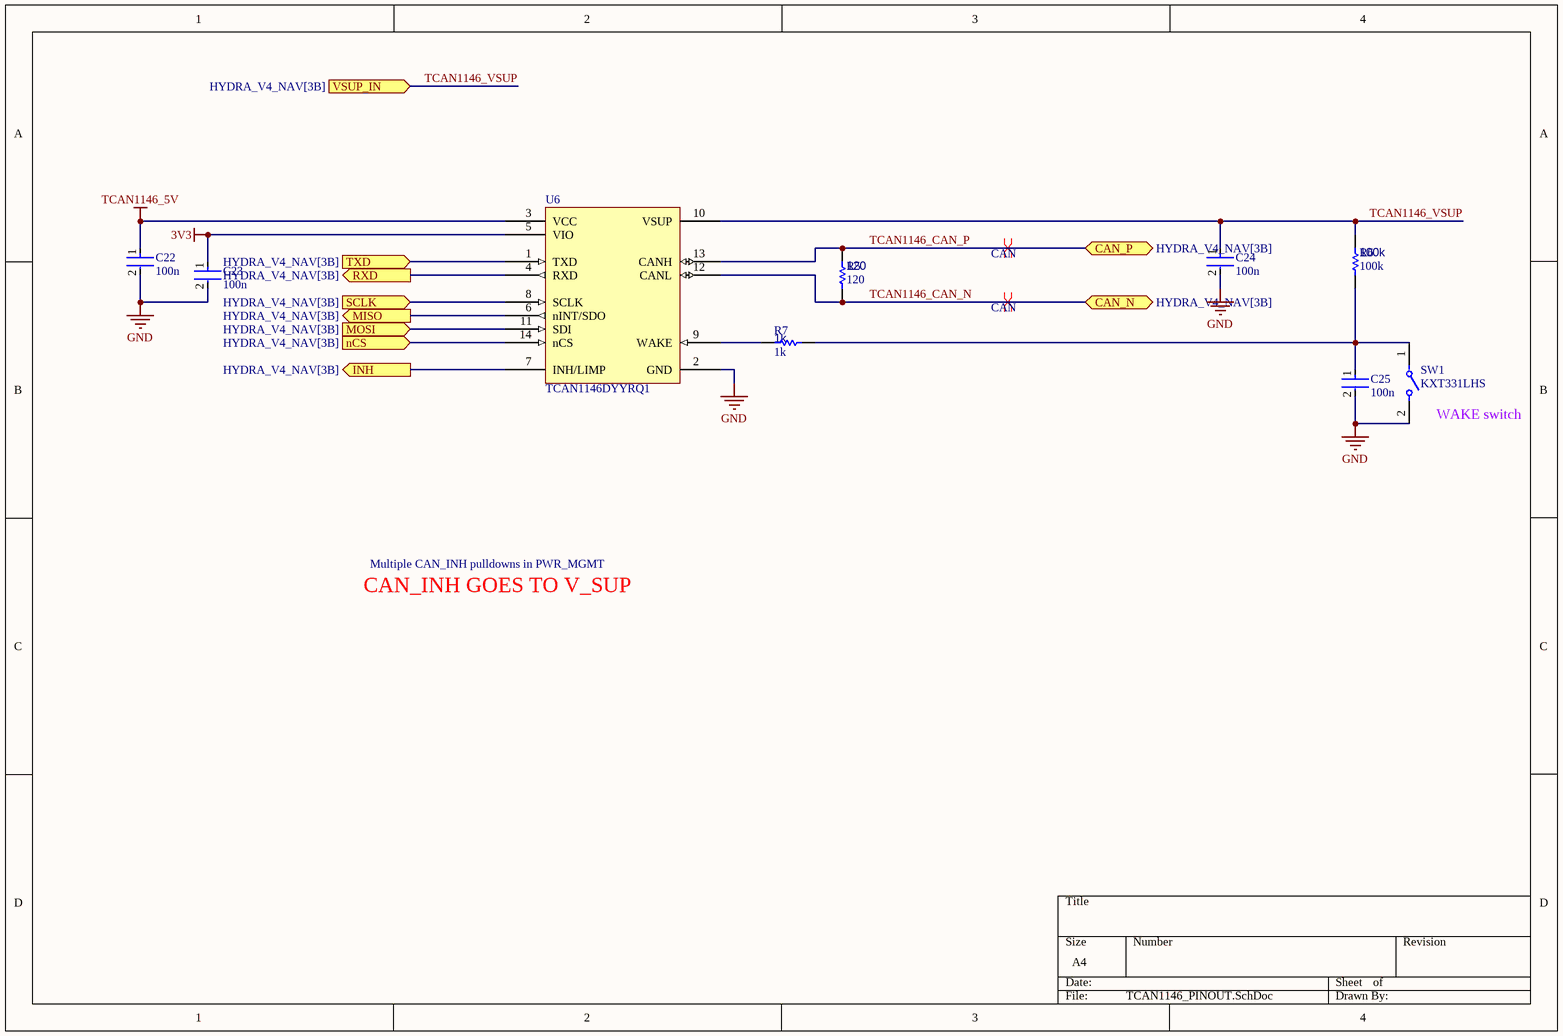
[diagram p9: TCAN1146_PINOUT.SchDoc]

### Parts
C22  100n  [FP-0402-L_1_0_0_05-W_0_5-IPC_A]
C23  100n  [FP-0402-L_1_0_0_05-W_0_5-IPC_A]
C24  100n  [FP-0402-L_1_0_0_05-W_0_5-IPC_A]
C25  100n  [FP-0402-L_1_0_0_05-W_0_5-IPC_A]
R5  120  [R0603B]
R6  100k  [R0603B]
R7  1k  [R0603B]
SW1  KXT331LHS  [FP-KXT331LHS-MFG]
U6  TCAN1146DYYRQ1  [TCAN1146DYYRQ1-Footprint-1]

### Ports
CAN_N (bidir, see HYDRA_V4_NAV[3B]), CAN_P (bidir, see HYDRA_V4_NAV[3B]), INH (out, see HYDRA_V4_NAV[3B]), MISO (out, see HYDRA_V4_NAV[3B]), MOSI (in, see HYDRA_V4_NAV[3B]), nCS (in, see HYDRA_V4_NAV[3B]), RXD (out, see HYDRA_V4_NAV[3B]), SCLK (in, see HYDRA_V4_NAV[3B]), TXD (in, see HYDRA_V4_NAV[3B]), VSUP_IN (in, see HYDRA_V4_NAV[3B])

### Nets
3V3: C23.1 U6.5(VIO)
GND: C22.2 C23.2 C24.2 C25.2 SW1.2 U6.2(GND)
TCAN1146_5V: C22.1 U6.3(VCC)
TCAN1146_VSUP: C24.1 R6.2 U6.10(VSUP) ; port VSUP_IN
PRE_ZENER_CAN_INH: U6.7(INH/LIMP) ; port INH
TCAN1146_CAN_N: R5.1 U6.12(CANL) ; port CAN_N  [project net CAN0_N]
TCAN1146_CAN_P: R5.2 U6.13(CANH) ; port CAN_P  [project net CAN0_P]
NetC25_1: C25.1 R6.1 R7.1 SW1.1
NetR7_2: R7.2 U6.9(WAKE)
NetU1_51: U6.14(nCS) ; port nCS
NetU1_52: U6.8(SCLK) ; port SCLK
NetU1_53: U6.6(nINT/SDO) ; port MISO
NetU1_54: U6.11(SDI) ; port MOSI
NetU1_59: U6.4(RXD) ; port RXD
NetU1_60: U6.1(TXD) ; port TXD

### Layout directives
differential pair; differential pair class CAN: CAN0_N, CAN0_P

### Notes on the sheet
- (near SW1) WAKE switch
- Multiple CAN_INH pulldowns in PWR_MGMT
- CAN_INH GOES TO V_SUP

### Library data of the parts
C22-C25 = CMP-001-00058-1: as C3 on sheet STM32H730_PINOUT; Value: 100n; Min Operating Temperature: -55°C; Mounting Technology: Surface Mount; Pins: 2; Case/Package: 0402; RoHS Compliant: Yes; Max Operating Temperature: 85°C
R5-R7 = CMP-009-00002-14: Resistor
  R5: Value: 120
  R6: Value: 100k
  R7: Value: 1k
SW1 = CMP-10040-000029-1: as SW2 on sheet STM32H730_PINOUT; Contact Plating: Gold; Insulation Color: Black; Min Operating Temperature: -40°C; Packaging: Tape and Reel; Flammability Rating: UL94 V-0; Max Operating Temperature: 85°C; Termination: Solder; Mount: Surface Mount
U6 = CMP-318-000000-2: Automotive CAN FD transceiver with watchdog, bus diagnostics and partial networking via sele 14-SOT-23-THIN -40 to 150; Component Type: Standard; Design Item ID: CMP-015-00012-2; Pin Count: 14; Source: TCAN1146DYYRQ1.SchLib